# EAGLE design controller (EAGLE 8.6.3)

## Sheet 1 of 3
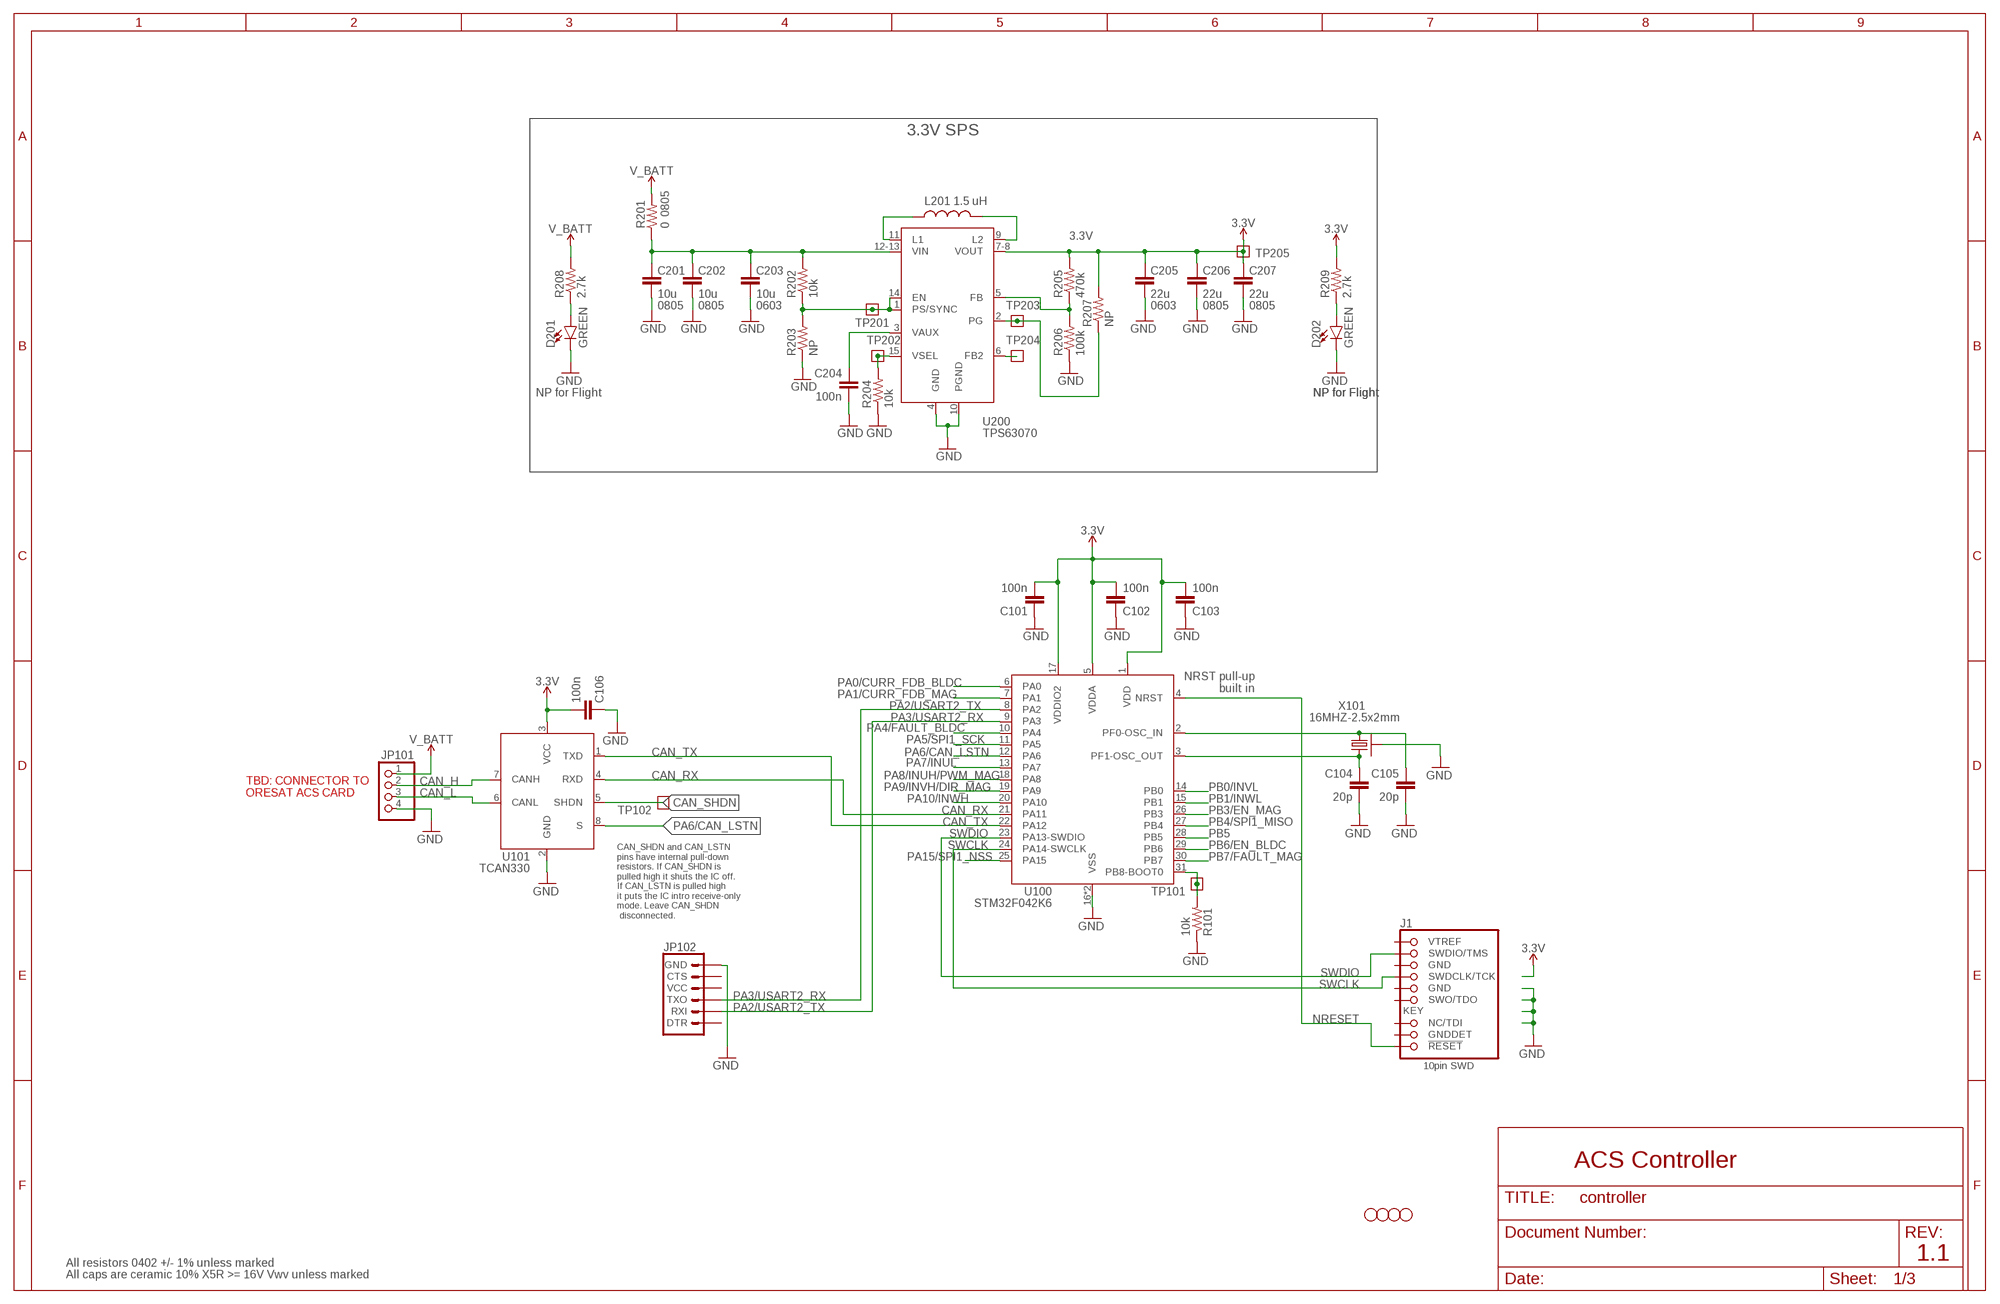
[diagram p0: schematic, sheet 1]

### Parts
C101  100n  C-EU0402-B-NOSILK  [.0402-B-NOSILK]
C102  100n  C-EU0402-B-NOSILK  [.0402-B-NOSILK]
C103  100n  C-EU0402-B-NOSILK  [.0402-B-NOSILK]
C104  20p  C-EU0402-B-NOSILK  [.0402-B-NOSILK]
C105  20p  C-EU0402-B-NOSILK  [.0402-B-NOSILK]
C106  100n  C-EU0402-B-NOSILK  [.0402-B-NOSILK]
C201  10u  C-EU0805-B-NOSILK  [.0805-B-NOSILK]
C202  10u  C-EU0805-B-NOSILK  [.0805-B-NOSILK]
C203  10u  C-EU0603-B-NOSILK  [.0603-B-NOSILK]
C204  100n  C-EU0402-B-NOSILK  [.0402-B-NOSILK]
C205  22u  C-EU0603-B-NOSILK  [.0603-B-NOSILK]
C206  22u  C-EU0805-B-NOSILK  [.0805-B-NOSILK]
C207  22u  C-EU0805-B-NOSILK  [.0805-B-NOSILK]
D201  GREEN  LED-GREEN0603  [LED-0603]
D202  GREEN  LED-GREEN0603  [LED-0603]
H1  STAND-OFFTIGHT  [STAND-OFF-TIGHT]
H2  STAND-OFFTIGHT  [STAND-OFF-TIGHT]
H3  STAND-OFFTIGHT  [STAND-OFF-TIGHT]
H4  STAND-OFFTIGHT  [STAND-OFF-TIGHT]
J1  1.27MM-SWD-CONNECTOR  [1.27MM_2X5]
JP101  PINHD-1X4  [1X04]
JP102  6_PIN_SERIAL_TARGETSILK  [6_PIN_SERIAL_TARGET_SIDE_W_SILK]
L201  1.5 uH  L-COILCRAFT-XFL4020  [L-COILCRAFT-XFL4020]
R101  10k  R-US_0402-B-NOSILK  [.0402-B-NOSILK]
R201  0  R-US_0805-B-NOSILK  [.0805-B-NOSILK]
R202  10k  R-US_0402-B-NOSILK  [.0402-B-NOSILK]
R203  NP  R-US_0402-B-NOSILK  [.0402-B-NOSILK]
R204  10k  R-US_0402-B-NOSILK  [.0402-B-NOSILK]
R205  470k  R-US_0402-B-NOSILK  [.0402-B-NOSILK]
R206  100k  R-US_0402-B-NOSILK  [.0402-B-NOSILK]
R207  NP  R-US_0402-B-NOSILK  [.0402-B-NOSILK]
R208  2.7k  R-US_0402-B-NOSILK  [.0402-B-NOSILK]
R209  2.7k  R-US_0402-B-NOSILK  [.0402-B-NOSILK]
TP101  TEST-POINT  [2MM-TEST-POINT]
TP102  TEST-POINT  [2MM-TEST-POINT]
TP201  TEST-POINT  [2MM-TEST-POINT]
TP202  TEST-POINT  [2MM-TEST-POINT]
TP203  TEST-POINT  [2MM-TEST-POINT]
TP204  TEST-POINT  [2MM-TEST-POINT]
TP205  TEST-POINT  [2MM-TEST-POINT]
U100  STM32F042K6  [QFP32-7X7]
U101  TCAN330  [SOT23-8_TI-DCN]
U200  TPS63070  TPS63070X  [TPS63070X]
X101  16MHZ-2.5x2mm  CRYSTAL-WITH-GND  [CRYSTAL_2.5X2]

### Nets
3.3V: C101.2 C102.2 C103.2 C106.2 C205.1 C206.1 C207.1 R205.2 R207.2 R209.2 TP205.1 U100.1(VDD) U100.5(VDDA) U100.17(VDDIO2) U101.3(VCC) U200.7-8(VOUT) ; also sheet 2,3
BOOT: R101.2 TP101.1 U100.31(PB8-BOOT0)
CAN_H: JP101.2 U101.7(CANH)
CAN_L: JP101.3 U101.6(CANL)
CAN_RX: U100.21(PA11) U101.4(RXD)
CAN_SHDN: TP102.1 U101.5(SHDN)
CAN_TX: U100.22(PA12) U101.1(TXD)
CRYSTALIN: C105.1 U100.2(PF0-OSC_IN) X101.1
CRYSTALOUT: C104.1 U100.3(PF1-OSC_OUT) X101.3
GND: C101.1 C102.1 C103.1 C104.2 C105.2 C106.1 C201.2 C202.2 C203.2 C204.2 C205.2 C206.2 C207.2 D201.C D202.C JP101.4 JP102.P$6(GND) R101.1 R203.1 R204.1 R206.1 U100.16(VSS) U100.32(VSS) U101.2(GND) U200.4(GND) U200.10(PGND) X101.2(SHIELD) X101.4(SHIELD) ; also sheet 2,3
N$270: D201.A R208.1
N$271: D202.A R209.1
NRESET: J1.!RESET U100.4(NRST)
PA0/CURR_FDB_BLDC: U100.6(PA0) ; also sheet 2
PA1/CURR_FDB_MAG: U100.7(PA1) ; also sheet 3
PA2/USART2_TX: JP102.P$2(TXO) U100.8(PA2)
PA3/USART2_RX: JP102.P$3(RXI) U100.9(PA3)
PA4/FAULT_BLDC: U100.10(PA4) ; also sheet 2
PA5/SPI1_SCK: U100.11(PA5) ; also sheet 2
PA6/CAN_LSTN: U100.12(PA6) U101.8(S)
PA7/INUL: U100.13(PA7) ; also sheet 2
PA8/INUH/PWM_MAG: U100.18(PA8) ; also sheet 2,3
PA9/INVH/DIR_MAG: U100.19(PA9) ; also sheet 2,3
PA10/INWH: U100.20(PA10) ; also sheet 2
PA15/SPI1_NSS: U100.25(PA15) ; also sheet 2
PB0/INVL: U100.14(PB0) ; also sheet 2
PB1/INWL: U100.15(PB1) ; also sheet 2
PB3/EN_MAG: U100.26(PB3) ; also sheet 3
PB4/SPI1_MISO: U100.27(PB4) ; also sheet 2
PB5: U100.28(PB5)
PB6/EN_BLDC: U100.29(PB6) ; also sheet 2
PB7/FAULT_MAG: U100.30(PB7) ; also sheet 3
SWCLK: J1.SWDCLK(SWDCLK/TCK) U100.24(PA14-SWCLK)
SWDIO: J1.SWDIO(SWDIO/TMS) U100.23(PA13-SWDIO)
TPS-EN: R202.1 R203.2 TP201.1 U200.1(PS/SYNC) U200.14(EN)
TPS-FB: R205.1 R206.2 U200.5(FB)
TPS-FB2: TP204.1 U200.6(FB2)
TPS-L1: L201.1 U200.11(L1)
TPS-L2: L201.2 U200.9(L2)
TPS-PG: R207.1 TP203.1 U200.2(PG)
TPS-VAUX: C204.1 U200.3(VAUX)
TPS-VIN: C201.1 C202.1 C203.1 R201.1 R202.2 U200.12-13(VIN)
TPS-VSEL: R204.2 TP202.1 U200.15(VSEL)
V_BATT: JP101.1 R201.2 R208.2 ; also sheet 2,3
Unconnected: J1.GND J1.GND@2(GND) J1.GNDDET J1.NC(NC/TDI) J1.SWO(SWO/TDO) J1.VTREF JP102.P$1(DTR) JP102.P$4(VCC) JP102.P$5(CTS)

### Notes on the sheet
- 3.3V SPS
- 0805
- 0805 | 0805 | 0603 | 0603 | 0805 | 0805
- NP for Flight | NP for Flight | NP for Flight
- NRST pull-up
  built in
- TBD: CONNECTOR TO 
  ORESAT ACS CARD
- CAN_SHDN and CAN_LSTN
  pins have internal pull-down
  resistors. If CAN_SHDN is 
  pulled high it shuts the IC off.
  If CAN_LSTN is pulled high
  it puts the IC intro receive-only
  mode. Leave CAN_SHDN
   disconnected.
- ACS Controller
- 1.1
- All resistors 0402 +/- 1% unless marked
- All caps are ceramic 10% X5R >= 16V Vwv unless marked

## Sheet 2 of 3
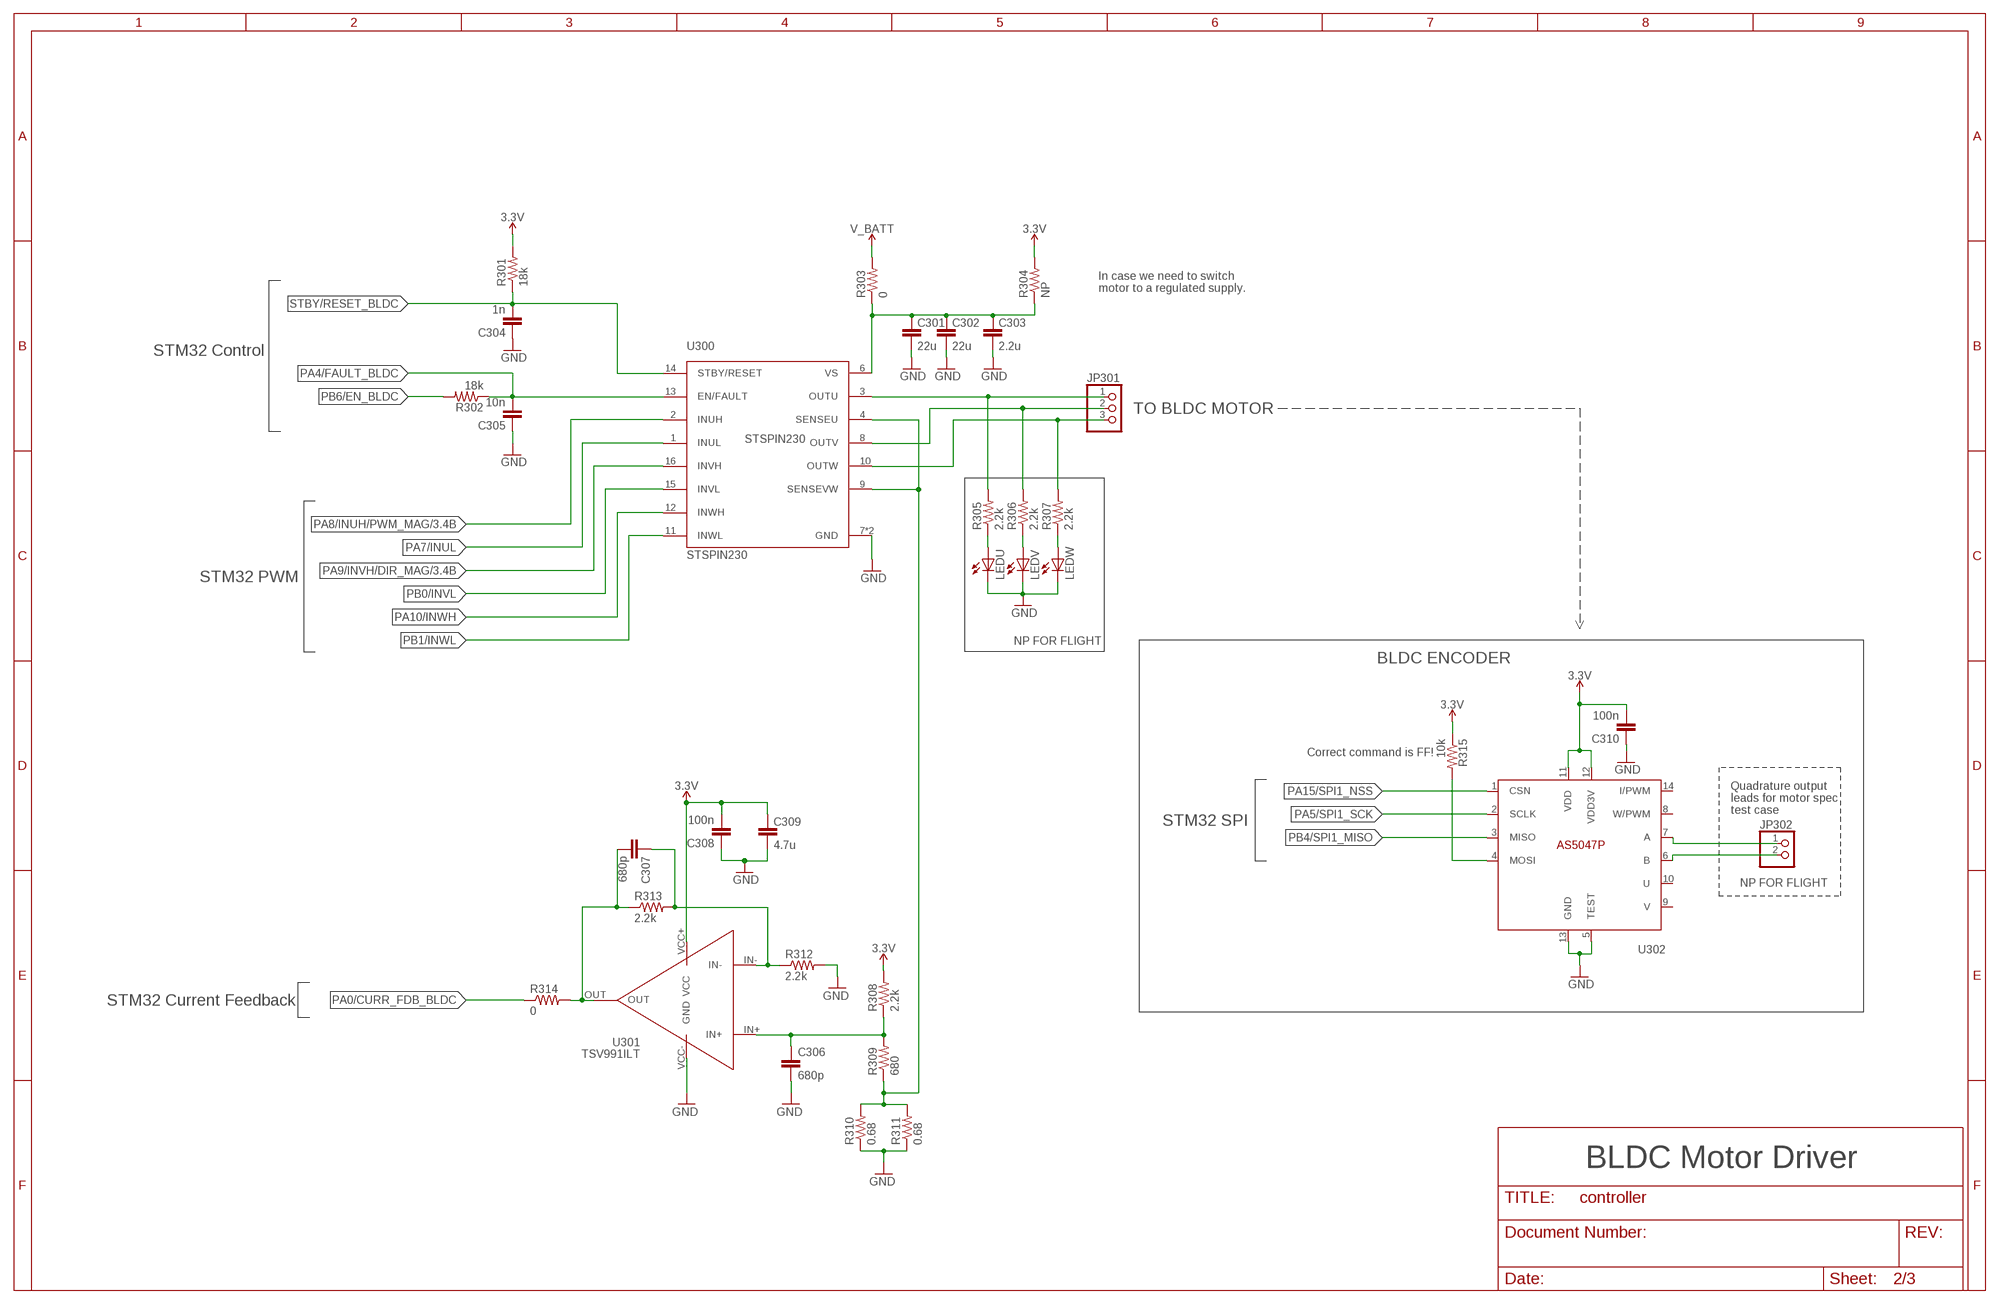
[diagram p1: schematic, sheet 2]

### Parts
C301  22u  C-EU0603-B-NOSILK  [.0603-B-NOSILK]
C302  22u  C-EU0603-B-NOSILK  [.0603-B-NOSILK]
C303  2.2u  C-EU0603-B-NOSILK  [.0603-B-NOSILK]
C304  1n  C-EU0402-B-NOSILK  [.0402-B-NOSILK]
C305  10n  C-EU0402-B-NOSILK  [.0402-B-NOSILK]
C306  680p  C-EU0402-B-NOSILK  [.0402-B-NOSILK]
C307  680p  C-EU0402-B-NOSILK  [.0402-B-NOSILK]
C308  100n  C-EU0402-B-NOSILK  [.0402-B-NOSILK]
C309  4.7u  C-EU0603-B-NOSILK  [.0603-B-NOSILK]
C310  100n  C-EU0402-B-NOSILK  [.0402-B-NOSILK]
JP301  PINHD-1X3  [1X03]
JP302  PINHD-1X2  [1X02]
LEDU  LEDCHIP-LED0603  [CHIP-LED0603]
LEDV  LEDCHIP-LED0603  [CHIP-LED0603]
LEDW  LEDCHIP-LED0603  [CHIP-LED0603]
R301  18k  R-US_0402-B-NOSILK  [.0402-B-NOSILK]
R302  18k  R-US_0402-B-NOSILK  [.0402-B-NOSILK]
R303  0  R-US_0805-B-NOSILK  [.0805-B-NOSILK]
R304  NP  R-US_0805-B-NOSILK  [.0805-B-NOSILK]
R305  2.2k  R-US_0805-B-NOSILK  [.0805-B-NOSILK]
R306  2.2k  R-US_0805-B-NOSILK  [.0805-B-NOSILK]
R307  2.2k  R-US_0805-B-NOSILK  [.0805-B-NOSILK]
R308  2.2k  R-US_0402-B-NOSILK  [.0402-B-NOSILK]
R309  680  R-US_0402-B-NOSILK  [.0402-B-NOSILK]
R310  0.68  R-US_0805-B-NOSILK  [.0805-B-NOSILK]
R311  0.68  R-US_0805-B-NOSILK  [.0805-B-NOSILK]
R312  2.2k  R-US_0402-B-NOSILK  [.0402-B-NOSILK]
R313  2.2k  R-US_0402-B-NOSILK  [.0402-B-NOSILK]
R314  0  R-US_0402-B-NOSILK  [.0402-B-NOSILK]
R315  10k  R-US_0402-B-NOSILK  [.0402-B-NOSILK]
U300  STSPIN230  [VFQFPN]
U301  TSV991ILT  [SOT23-5]
U302  AS5047P  [TSSOP14]

### Nets
3.3V: C308.2 C309.1 C310.2 R301.2 R304.2 R308.2 R315.1 U301.VCC+(VCC) U302.11(VDD) U302.12(VDD3V) ; also sheet 1,3
GND: C301.2 C302.2 C303.2 C304.1 C305.1 C306.2 C308.1 C309.2 C310.1 LEDU.C LEDV.C LEDW.C R310.1 R311.1 R312.2 U300.7(GND) U300.EPAD(GND) U301.VCC-(GND) U302.5(TEST) U302.13(GND) ; also sheet 1,3
N$1: R315.2 U302.4(MOSI)
N$4: JP302.1 U302.7(A)
N$6: LEDU.A R305.1
N$10: LEDV.A R306.1
N$11: LEDW.A R307.1
N$12: C301.1 C302.1 C303.1 R303.1 R304.1 U300.6(VS)
N$13: JP302.2 U302.6(B)
N$14: C307.1 R312.1 R313.2 U301.IN-
N$16: C306.1 R308.1 R309.2 U301.IN+
N$29: C307.2 R313.1 R314.2 U301.OUT
PA0/CURR_FDB_BLDC: R314.1 ; also sheet 1
PA4/FAULT_BLDC: C305.2 R302.1 U300.13(EN/FAULT) ; also sheet 1
PA5/SPI1_SCK: U302.2(SCLK) ; also sheet 1
PA7/INUL: U300.1(INUL) ; also sheet 1
PA8/INUH/PWM_MAG: U300.2(INUH) ; also sheet 1,3
PA9/INVH/DIR_MAG: U300.16(INVH) ; also sheet 1,3
PA10/INWH: U300.12(INWH) ; also sheet 1
PA15/SPI1_NSS: U302.1(CSN) ; also sheet 1
PB0/INVL: U300.15(INVL) ; also sheet 1
PB1/INWL: U300.11(INWL) ; also sheet 1
PB4/SPI1_MISO: U302.3(MISO) ; also sheet 1
PB6/EN_BLDC: R302.2 ; also sheet 1
SENSE_BLDC: R309.1 R310.2 R311.2 U300.4(SENSEU) U300.9(SENSEVW)
STBY/RESET_BLDC: C304.2 R301.1 U300.14(STBY/RESET)
U: JP301.1 R305.2 U300.3(OUTU)
V: JP301.2 R306.2 U300.8(OUTV)
V_BATT: R303.2 ; also sheet 1,3
W: JP301.3 R307.2 U300.10(OUTW)
Unconnected: U302.8(W/PWM) U302.9(V) U302.10(U) U302.14(I/PWM)

### Notes on the sheet
- In case we need to switch 
  motor to a regulated supply.
- STM32 Control
- TO BLDC MOTOR
- STM32 PWM
- NP FOR FLIGHT
- BLDC ENCODER
- Correct command is FF!
- Quadrature output
  leads for motor spec
  test case
- STM32 SPI
- NP FOR FLIGHT
- STM32 Current Feedback
- BLDC Motor Driver

## Sheet 3 of 3
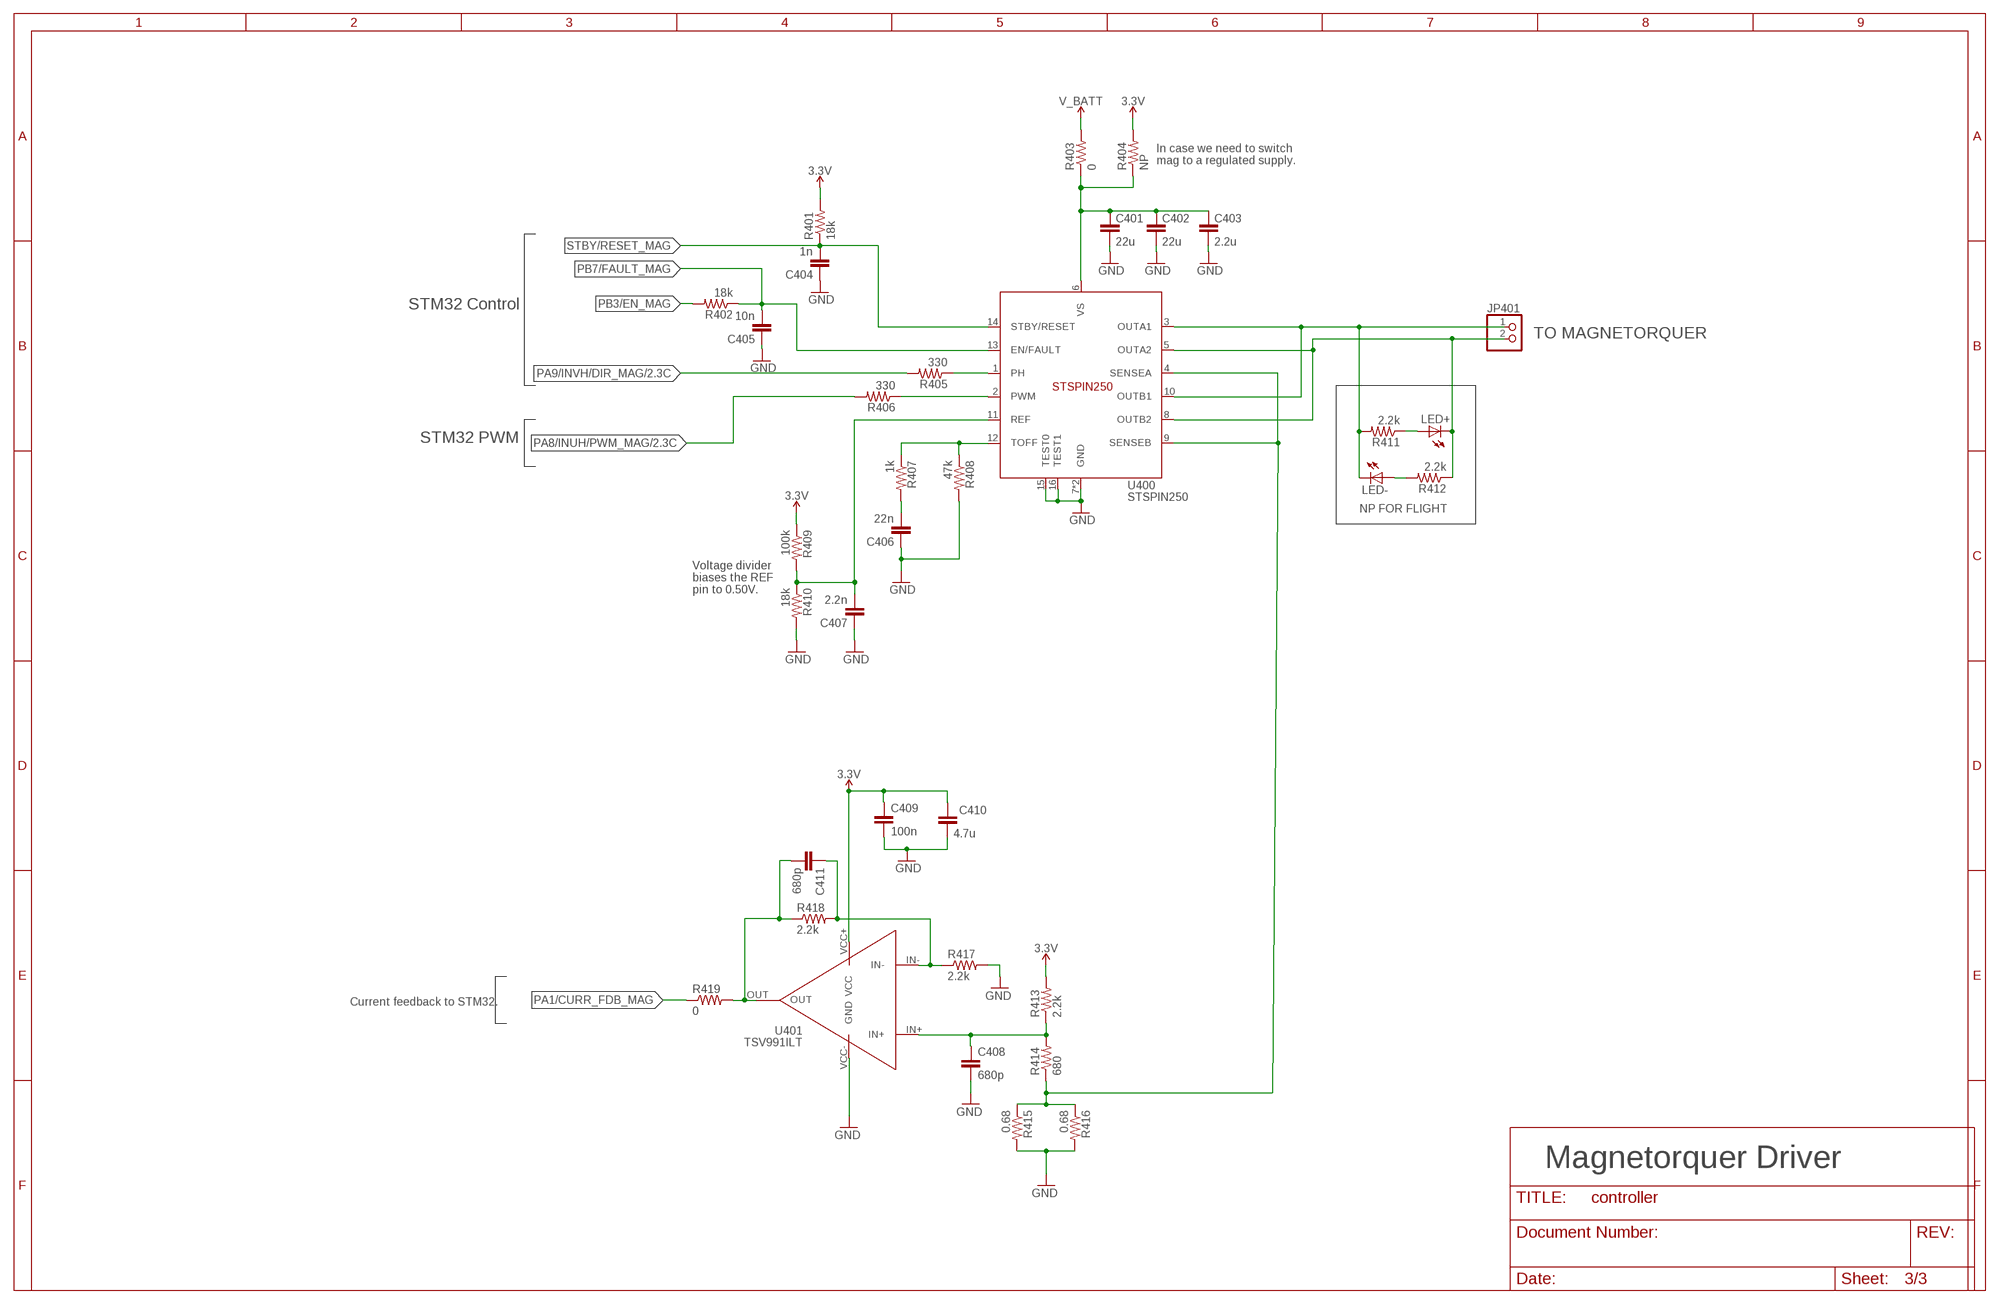
[diagram p2: schematic, sheet 3]

### Parts
C401  22u  C-EU0603-B-NOSILK  [.0603-B-NOSILK]
C402  22u  C-EU0603-B-NOSILK  [.0603-B-NOSILK]
C403  2.2u  C-EU0603-B-NOSILK  [.0603-B-NOSILK]
C404  1n  C-EU0402-B-NOSILK  [.0402-B-NOSILK]
C405  10n  C-EU0402-B-NOSILK  [.0402-B-NOSILK]
C406  22n  C-EU0402-B-NOSILK  [.0402-B-NOSILK]
C407  2.2n  C-EU0402-B-NOSILK  [.0402-B-NOSILK]
C408  680p  C-EU0402-B-NOSILK  [.0402-B-NOSILK]
C409  100n  C-EU0402-B-NOSILK  [.0402-B-NOSILK]
C410  4.7u  C-EU0603-B-NOSILK  [.0603-B-NOSILK]
C411  680p  C-EU0402-B-NOSILK  [.0402-B-NOSILK]
JP401  PINHD-1X2  [1X02]
LED+  LEDCHIP-LED0603  [CHIP-LED0603]
LED-  LEDCHIP-LED0603  [CHIP-LED0603]
R401  18k  R-US_0402-B-NOSILK  [.0402-B-NOSILK]
R402  18k  R-US_0402-B-NOSILK  [.0402-B-NOSILK]
R403  0  R-US_0805-B-NOSILK  [.0805-B-NOSILK]
R404  NP  R-US_0805-B-NOSILK  [.0805-B-NOSILK]
R405  330  R-US_0402-B-NOSILK  [.0402-B-NOSILK]
R406  330  R-US_0402-B-NOSILK  [.0402-B-NOSILK]
R407  1k  R-US_0402-B-NOSILK  [.0402-B-NOSILK]
R408  47k  R-US_0402-B-NOSILK  [.0402-B-NOSILK]
R409  100k  R-US_0402-B-NOSILK  [.0402-B-NOSILK]
R410  18k  R-US_0402-B-NOSILK  [.0402-B-NOSILK]
R411  2.2k  R-US_0805-B-NOSILK  [.0805-B-NOSILK]
R412  2.2k  R-US_0805-B-NOSILK  [.0805-B-NOSILK]
R413  2.2k  R-US_0402-B-NOSILK  [.0402-B-NOSILK]
R414  680  R-US_0402-B-NOSILK  [.0402-B-NOSILK]
R415  0.68  R-US_0805-B-NOSILK  [.0805-B-NOSILK]
R416  0.68  R-US_0805-B-NOSILK  [.0805-B-NOSILK]
R417  2.2k  R-US_0402-B-NOSILK  [.0402-B-NOSILK]
R418  2.2k  R-US_0402-B-NOSILK  [.0402-B-NOSILK]
R419  0  R-US_0402-B-NOSILK  [.0402-B-NOSILK]
U400  STSPIN250  [VFQPN]
U401  TSV991ILT  [SOT23-5]

### Nets
3.3V: C409.1 C410.1 R401.2 R404.2 R409.1 R413.2 U401.VCC+(VCC) ; also sheet 1,2
GND: C401.2 C402.2 C403.2 C404.1 C405.1 C406.1 C407.1 C408.2 C409.2 C410.2 R408.2 R410.2 R415.2 R416.2 R417.2 U400.7(GND) U400.15(TEST0) U400.16(TEST1) U400.EPAD(GND) U401.VCC-(GND) ; also sheet 1,2
N$2: C406.2 R407.2
N$3: R406.1 U400.2(PWM)
N$5: R405.1 U400.1(PH)
N$15: C408.1 R413.1 R414.2 U401.IN+
N$17: C411.1 R417.1 R418.2 U401.IN-
N$19: R407.1 R408.1 U400.12(TOFF)
N$20: C401.1 C402.1 C403.1 R403.1 R404.1 U400.6(VS)
N$22: LED+.A R411.1
N$23: LED-.A R412.2
N$25: C407.2 R409.2 R410.1 U400.11(REF)
N$27: C411.2 R418.1 R419.2 U401.OUT
OUT1: JP401.1 LED-.C R411.2 U400.3(OUTA1) U400.10(OUTB1)
OUT2: JP401.2 LED+.C R412.1 U400.5(OUTA2) U400.8(OUTB2)
PA1/CURR_FDB_MAG: R419.1 ; also sheet 1
PA8/INUH/PWM_MAG: R406.2 ; also sheet 1,2
PA9/INVH/DIR_MAG: R405.2 ; also sheet 1,2
PB3/EN_MAG: R402.2 ; also sheet 1
PB7/FAULT_MAG: C405.2 R402.1 U400.13(EN/FAULT) ; also sheet 1
SENSE_MAG: R414.1 R415.1 R416.1 U400.4(SENSEA) U400.9(SENSEB)
STBY/RESET_MAG: C404.2 R401.1 U400.14(STBY/RESET)
V_BATT: R403.2 ; also sheet 1,2

### Notes on the sheet
- In case we need to switch 
  mag to a regulated supply.
- STM32 Control
- TO MAGNETORQUER
- STM32 PWM
- NP FOR FLIGHT
- Voltage divider
  biases the REF
  pin to 0.50V.
- Current feedback to STM32.
- Magnetorquer Driver

## Library data of the parts
C101-C103 C106 C204 C304-C308 C310 C404-C409 C411 = rcl_custom:C-EU: CAPACITOR, European symbol; DIS: Digi-Key; DPN: 1276-1001-1-ND; MFR: Samsung; MPN: CL05B104KO5NNNC
C104 C105 = rcl_custom:C-EU: CAPACITOR, European symbol; DIS: Digi-Key; DPN: 1276-6601-1-ND; MFR: Samsung; MPN: CL05C200JB51PNC
C201 C202 C206 C207 = oresat-rcl:C-EU: CAPACITOR, European symbol
C203 C205 C301-C303 C309 C401-C403 C410 = oresat-rcl:C-EU: CAPACITOR, European symbol; DIS: Digi-Key; DPN: 1276-1001-1-ND; MFR: Samsung; MPN: CL05B104KO5NNNC
D201 D202 = SparkFun-LED:LED-GREEN: Green SMD LED Used in manufacturing of various products at SparkFun Packages: 0603 - SMD 0603 package [Product Link] <http://www.futureelectronics.com/en/technologies/semiconductors/optoelectronics/leds/Pages/9894312-LTST-C190GKT.aspx?CrossPart=HSMG-C190&IM=0> LilyPad 1206 - SMD1206 LilyPad package [Product Link] <http://www.futureelectronics.com/en/Technologies/Product.aspx?ProductID=IN150NGHARVATEKCORPORATION2049943&IM=0> 1206 - SMD1206 package [Product Link] <http://www.futureelectronics.com/en/technologies/semiconductors/optoelectronics/leds/Pages/8315665-LTST-C150KGKT.aspx?IM=0> 1206 Bottom Mount -SMD 1206 Bottom Mount [Product Link] <http://www.digikey.com/product-detail/en/lite-on-inc/LTST-C230KGKT/160-1456-1-ND/386854> SparkFun Products: Pro Mini 328 -5V <https://www.sparkfun.com/products/821> RedBoard <https://www.sparkfun.com/products/12757> MP3 Trigger <https://www.sparkfun.com/products/13720> Makey Makey <https://www.sparkfun.com/products/11076>; PROD_ID: DIO-00821
H1-H4 = SparkFun-Hardware:STAND-OFF: Stand Off Drill holes for mechanically mounting via screws, standoffs, etc. Note: Use the keepout ring to avoid running the screw head into surrounding components. Variant Overviews STAND-OFF - Mechanical footprint for a #4 phillips button head screw. STAND-OFF-TIGHT - Mechanical footprint for a #4 phillips button head screw, Example SparkFun Products Screw - Phillips Head (1/4", 4-40, 10 pack) <https://www.sparkfun.com/products/10453> (PRT-10453) Screw - Phillips Head (1/2", 4-40, 10 pack) <https://www.sparkfun.com/products/10452> (PRT-10452) Screw - Phillips Head (3/4", 4-40, 10 pack) <https://www.sparkfun.com/products/10451> (PRT-10451) Screw - Phillips Head (1", 4-40, 10 pack) <https://www.sparkfun.com/products/10450> (PRT-10450)
J1 = J-CNC-3220-10-0100-00-ARM-SWD-port:1.27MM-SWD-CONNECTOR: ARM SWD Programming Header. Example part is the CNC 3220-10-0100-00
JP101 = pinhead:PINHD-1X4: PIN HEADER
JP102 = SparkFun-Connectors:6_PIN_SERIAL_TARGET: 6-pin header connection for use with the "FTDI BASIC" pinout - TARGET SIDE. Also known as "Arduino Serial Program Header". It is used to mate with our FTDI Basic serial programmers using the Arduino IDE. Note, this device has "TARGET" in the name. It is intended to be used on a design that contains a target micro-controller that you wish to program. The "sister" device, named "CABLE" is inteneded to be used on a design that usually lives on the end of your USB cable and prvides the converter chip (FTDI232 or FTDI231x) to commnicate serial RX/TX. You can populate with some of these: Break Away Headers - Straight <https://www.sparkfun.com/products/116> (PRT-00116) For reference (or to suit your programming needs) check out these designs: SparkFun FTDI Basic Breakout - 5V <https://www.sparkfun.com/products/9716> (DEV-09716) SparkFun FTDI Basic Breakout - 3.3V <https://www.sparkfun.com/products/9873> (DEV-09873) SparkFun FTDI SmartBasic <https://www.sparkfun.com/products/12935> (DEV-12935) SparkFun Beefy 3 - FTDI Basic Breakout <https://www.sparkfun.com/products/13746> (DEV-13746)
JP301 = adafruit:PINHD-1X3: PIN HEADER
JP302 JP401 = pinhead:PINHD-1X2: PIN HEADER
L201 = L-Coilcraft-XFL4020:L-COILCRAFT-XFL4020; DIS: Mouser; DPN: 994-XFL4020-152MEB; MFR: Coilcraft; MPN: XFL4020-152ME
LED+ LED- LEDU LEDV LEDW = adafruit:LED: LED OSRAM: - CHIPLED LG R971, LG N971, LY N971, LG Q971, LY Q971, LO R971, LY R971 LH N974, LH R974 LS Q976, LO Q976, LY Q976 LO Q996 - Hyper CHIPLED LW Q18S LB Q993, LB Q99A, LB R99A - SideLED LS A670, LO A670, LY A670, LG A670, LP A670 LB A673, LV A673, LT A673, LW A673 LH A674 LY A675 LS A676, LA A676, LO A676, LY A676, LW A676 LS A679, LY A679, LG A679 - Hyper Micro SIDELED® LS Y876, LA Y876, LO Y876, LY Y876 LT Y87S - SmartLED LW L88C, LW L88S LB L89C, LB L89S, LG L890 LS L89K, LO L89K, LY L89K LS L896, LA L896, LO L896, LY L896 - TOPLED LS T670, LO T670, LY T670, LG T670, LP T670 LSG T670, LSP T670, LSY T670, LOP T670, LYG T670 LG T671, LOG T671, LSG T671 LB T673, LV T673, LT T673, LW T673 LH T674 LS T676, LA T676, LO T676, LY T676, LB T676, LH T676, LSB T676, LW T676 LB T67C, LV T67C, LT T67C, LS T67K, LO T67K, LY T67K, LW E67C LS E67B, LA E67B, LO E67B, LY E67B, LB E67C, LV E67C, LT E67C LW T67C LS T679, LY T679, LG T679 LS T770, LO T770, LY T770, LG T770, LP T770 LB T773, LV T773, LT T773, LW T773 LH T774 LS E675, LA E675, LY E675, LS T675 LS T776, LA T776, LO T776, LY T776, LB T776 LHGB T686 LT T68C, LB T68C - Hyper Mini TOPLED® LB M676 - Mini TOPLED Santana® LG M470 LS M47K, LO M47K, LY M47K Source: http://www.osram.convergy.de/
R101 R202-R209 R301 R302 R308 R309 R312-R315 R401 R402 R405-R410 R413 R414 R417-R419 = rcl_custom:R-US_: RESISTOR, American symbol; DIS: Digi-Key; DPN: 1276-4275-1-ND; MFR: Samsung; MPN: RC1005F6653CS
R201 = rcl_custom:R-US_: RESISTOR, American symbol; DIS: Digi-Key; DPN: RHM0.0ARCT-ND; MFR: Rohm; MPN: MCR10EZPJ000
R303-R307 R310 R311 R403 R404 R411 R412 R415 R416 = oresat-rcl:R-US_: RESISTOR, American symbol
TP101 TP102 TP201-TP205 = Tova:TEST-POINT
U100 = STM32F042K:STM32F042K6; DIS: Digi-Key; DPN: STM32F042K6T7-ND; MFR: STMicroelectronics; MPN: STM32F042K6T7
U101 = TCAN330:TCAN330; DIS: Digi-Key; DPN: 296-44211-1-ND; MFR: Texas Instruments; MPN: TCAN330GDCNT
U200 = ic-pwr-tps63070x:TPS63070X: TPS63070 2-V to 16-V Buck-Boost Converter With 3.6-A Switch Current
U300 = U-ST-STSPIN230-BLDC-controller:STSPIN230
U301 U401 = TSV991ILT:TSV991ILT
U302 = U-AMS-AS5047P-encoder:AS5047P
U400 = U-ST-STSPIN250-Brushed-DC-controller:STSPIN250
X101 = low-gain-radio:CRYSTAL-WITH-GND; DIS: Digi-Key; DPN: XC2181CT-ND; MFR: ECS Inc.; MPN: ECS-160-10-36Q-ES-TR

## Board
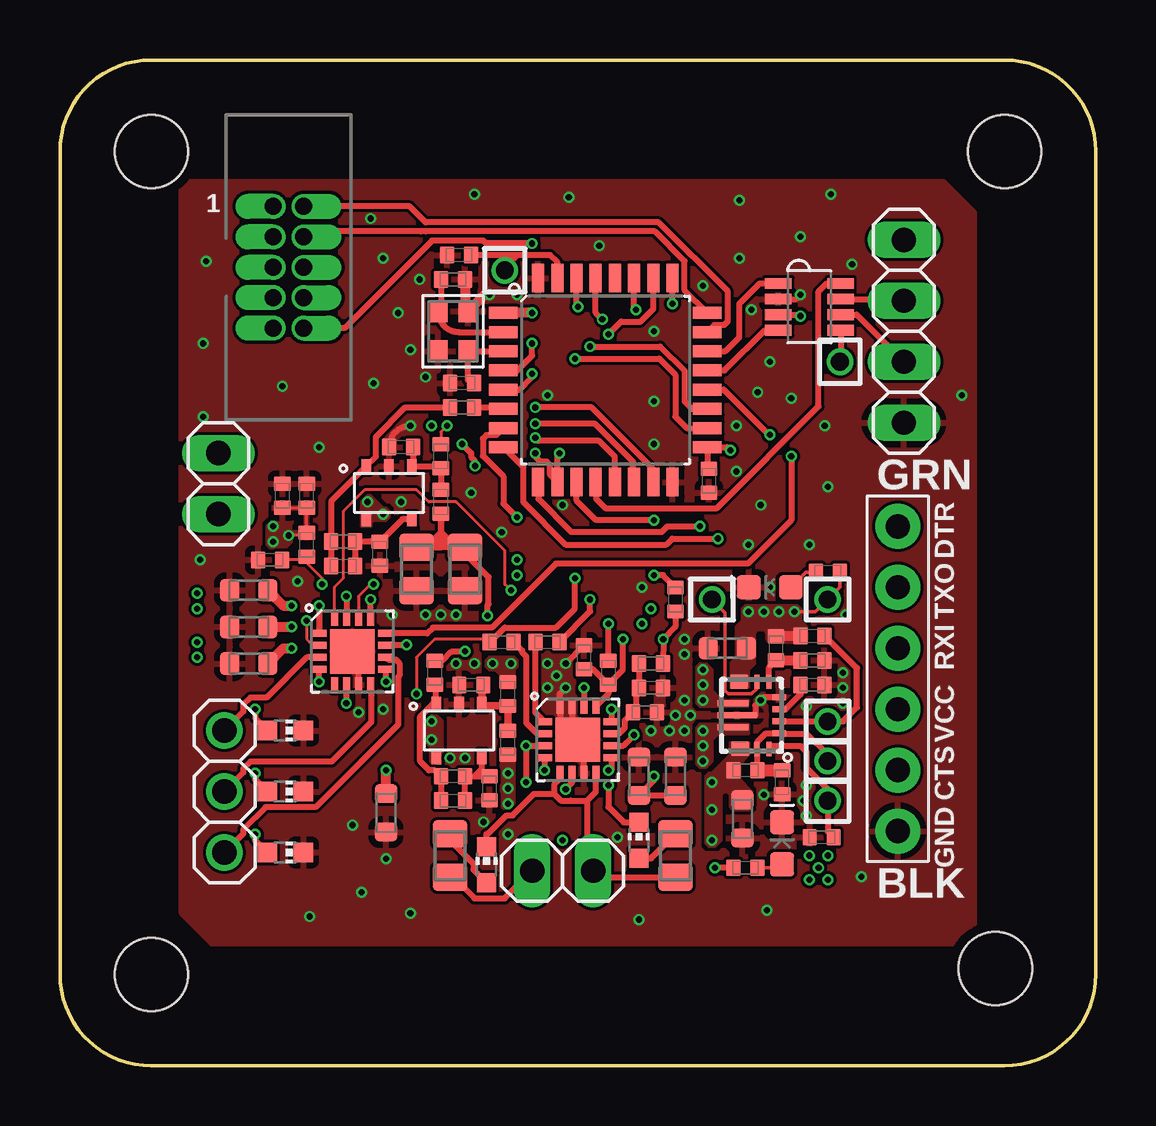
[diagram p3: board, top side]
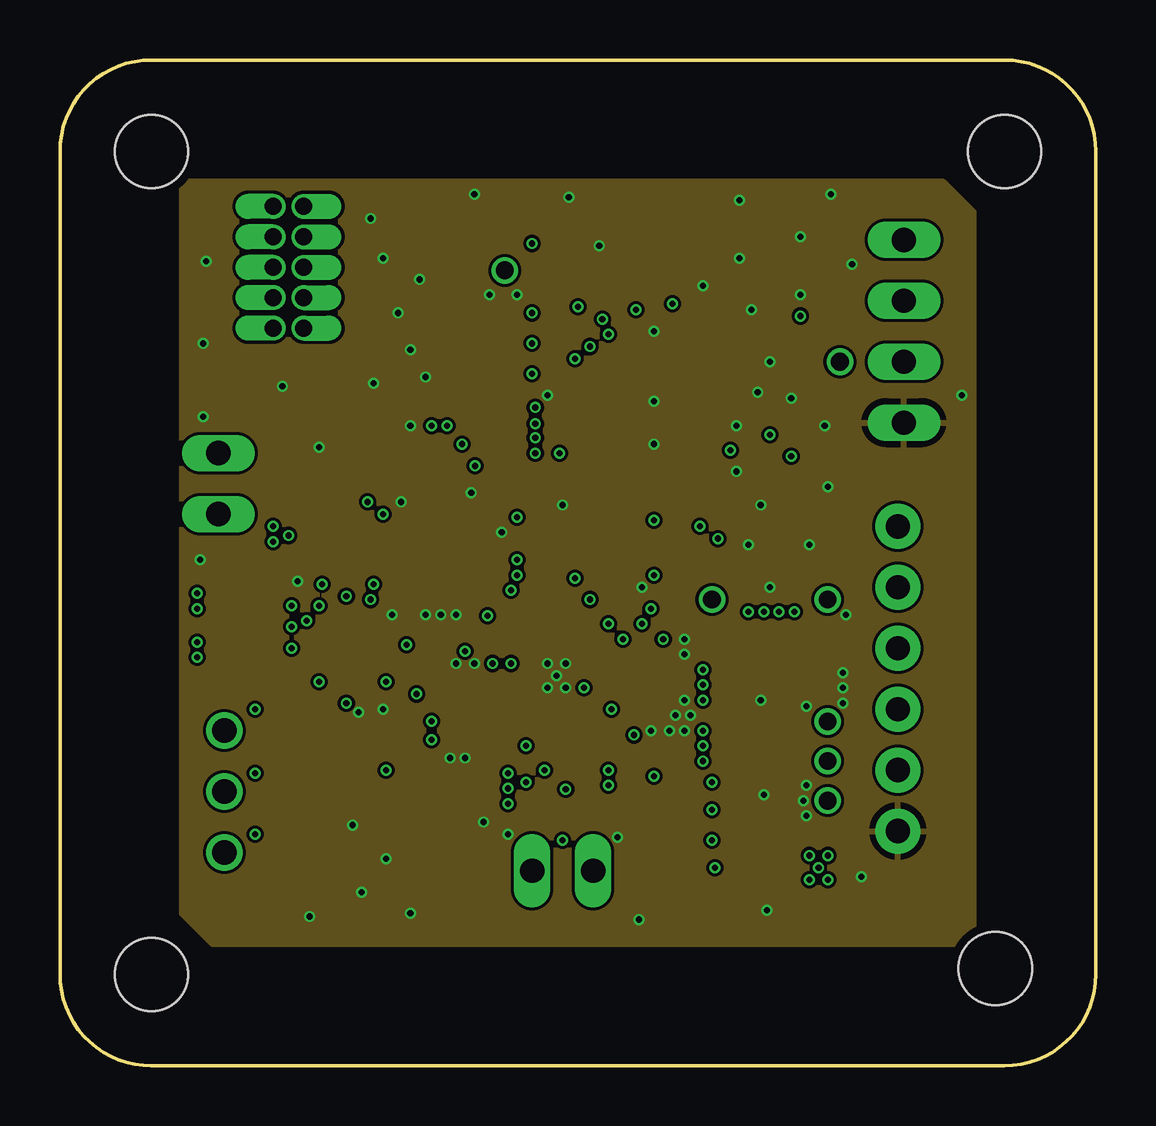
[diagram p4: board, inner layer Route2]
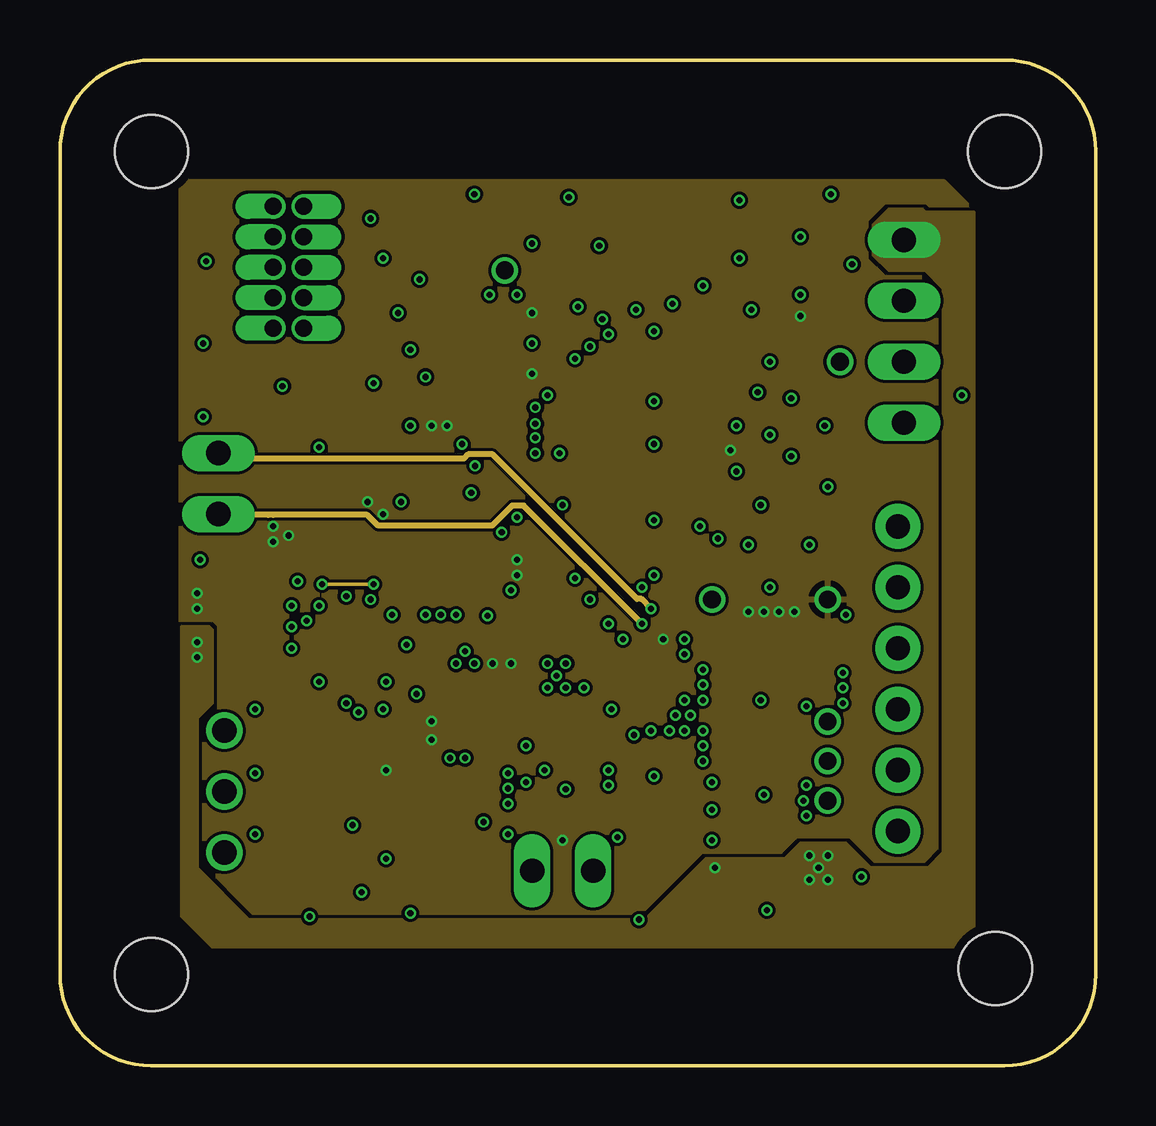
[diagram p5: board, inner layer Route15]
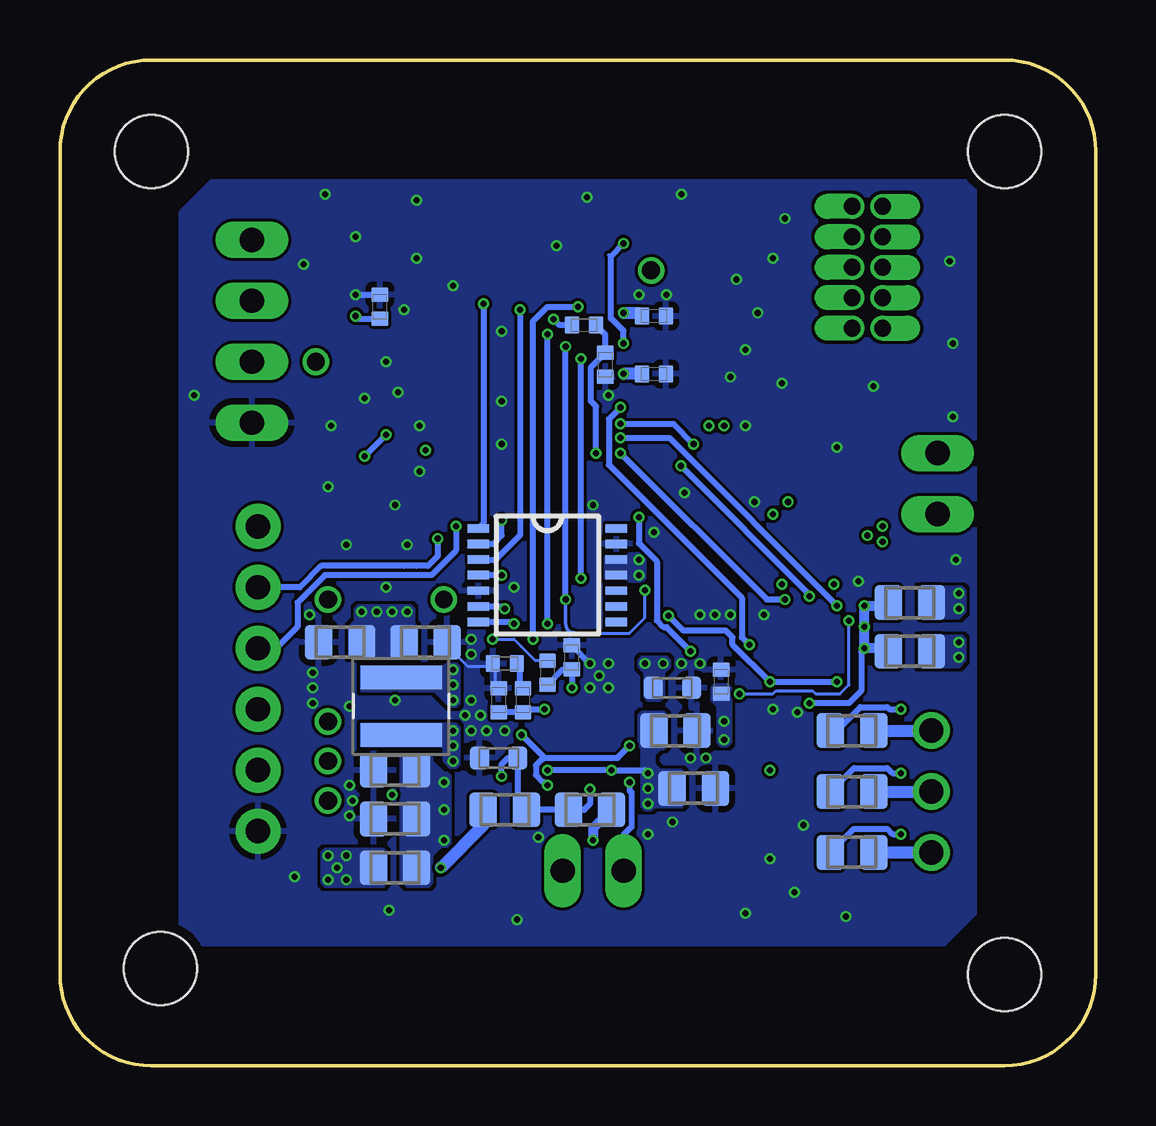
[diagram p6: board, bottom side, seen from below]

Size 43.18 x 41.91 mm. Coordinates in mm from the lower left corner, seen from the top.
Outline: 0,3.81 arc90 3.81,0 39.37,0 arc90 43.18,3.81 43.18,38.1 arc90 39.37,41.91 3.81,41.91 arc90 0,38.1 0,3.81
Copper layers (1*2*15*16): Top 0.035559375mm / dielectric 0.17018125mm / Route2 0.01778125mm / dielectric 47mil / Route15 0.01778125mm / dielectric 0.17018125mm / Bottom 0.035559375mm
Design rules "oshpark-4layer": minimum track width 5mil, minimum drill 10mil, track to track 5mil, track to pad 5mil, pad to pad 5mil, via to via 5mil, smd to smd 5mil, copper to edge 15mil, drill to drill 6mil, minimum pad ring 4mil, minimum via ring 4mil, stop-mask expansion 2.5mil, vias tented up to drill 0mil, thermal gap 10mil

### Footprints (pad centres in the part's own frame; a part is rotated, then mirrored left to right if it is on the bottom)
.0402-B-NOSILK = smd 0.6 x 0.7: 1 -0.5,0; 2 0.5,0
.0805-B-NOSILK = smd 1.15 x 1.45: 1 -0.9,0; 2 0.9,0
.0603-B-NOSILK = smd 0.8 x 0.95: 1 -0.8,0; 2 0.8,0
LED-0603 = smd 1 x 1: A -0.877,0; C 0.877,0
STAND-OFF-TIGHT = hole 3.048: 0,0
1.27MM_2X5 = drill 0.7 pad 1.016 offset: !RESET 0.635,-2.54; GND -0.635,1.27; GND@2 -0.635,0; GNDDET -0.635,-2.54; KEY -0.635,-1.27; NC 0.635,-1.27; SWDCLK 0.635,1.27; SWDIO 0.635,2.54; SWO 0.635,0; VTREF -0.635,2.54
1X04 = drill 1.016 long: 1 -3.81,0; 2 -1.27,0; 3 1.27,0; 4 3.81,0
6_PIN_SERIAL_TARGET_SIDE_W_SILK = drill 1.016 pad 1.88: P$1 -6.35,0; P$2 -3.81,0; P$3 -1.27,0; P$4 1.27,0; P$5 3.81,0; P$6 6.35,0
1X03 = drill 1.016: 1 -2.54,0; 2 0,0; 3 2.54,0
1X02 = drill 1.016 long: 1 -1.27,0; 2 1.27,0
L-COILCRAFT-XFL4020 = smd 0.98 x 3.4: 1 -1.2,0; 2 1.2,0
CHIP-LED0603 = smd 0.8 x 0.8: A 0,-0.75; C 0,0.75
2MM-TEST-POINT = drill 0.737: 1 0,0
QFP32-7X7 = smd 1.2 x 0.5: 1 -4.25,2.8; 2 -4.25,2; 3 -4.25,1.2; 4 -4.25,0.4; 5 -4.25,-0.4; 6 -4.25,-1.2; 7 -4.25,-2; 8 -4.25,-2.8; 17 4.25,-2.8; 18 4.25,-2; 19 4.25,-1.2; 20 4.25,-0.4; 21 4.25,0.4; 22 4.25,1.2; 23 4.25,2; 24 4.25,2.8 | smd 0.5 x 1.2: 9 -2.8,-4.25; 10 -2,-4.25; 11 -1.2,-4.25; 12 -0.4,-4.25; 13 0.4,-4.25; 14 1.2,-4.25; 15 2,-4.25; 16 2.8,-4.25; 25 2.8,4.25; 26 2,4.25; 27 1.2,4.25; 28 0.4,4.25; 29 -0.4,4.25; 30 -1.2,4.25; 31 -2,4.25; 32 -2.8,4.25
SOT23-8_TI-DCN = smd 0.45 x 1.1: 1 -0.975,-1.3; 2 -0.325,-1.3; 3 0.325,-1.3; 4 0.975,-1.3; 5 0.975,1.3; 6 0.325,1.3; 7 -0.325,1.3; 8 -0.975,1.3
TPS63070X = smd 0.6 x 0.25: 1 -1.15,0.75; 2 -1.15,0.25; 3 -1.15,-0.25; 4 -1.15,-0.75 | smd 0.25 x 0.6: 5 -0.725,-1.4; 6 -0.225,-1.4; 14 -0.225,1.4; 15 -0.725,1.4 | smd 0.75 x 0.6: 7-8 0.525,-1.4; 12-13 0.475,1.4 | smd 1.35 x 0.25: 9 0.775,-0.5; 11 0.775,0.5 | smd 1.7 x 0.25: 10 0.6,0
VFQFPN = smd 0.63 x 0.3: 1 -1.39,0.75; 2 -1.39,0.25; 3 -1.39,-0.25; 4 -1.39,-0.75; 9 1.39,-0.75; 10 1.39,-0.25; 11 1.39,0.25; 12 1.39,0.75 | smd 0.3 x 0.63: 5 -0.75,-1.39; 6 -0.25,-1.39; 7 0.25,-1.39; 8 0.75,-1.39; 13 0.75,1.39; 14 0.25,1.39; 15 -0.25,1.39; 16 -0.75,1.39 | smd 1.85 x 1.85: EPAD 0,0
SOT23-5 = smd 0.4 x 0.6: IN+ 0.95,1.1; IN- 0.95,-1.1; OUT -0.95,1.1; VCC+ -0.95,-1.1; VCC- 0,1.1
TSSOP14 = smd 0.9 x 0.35: 1 -2.875,1.95; 2 -2.875,1.3; 3 -2.875,0.65; 4 -2.875,0; 5 -2.875,-0.65; 6 -2.875,-1.3; 7 -2.875,-1.95; 8 2.875,-1.95; 9 2.875,-1.3; 10 2.875,-0.65; 11 2.875,0; 12 2.875,0.65; 13 2.875,1.3; 14 2.875,1.95
VFQPN = smd 0.63 x 0.3: 1 -1.39,0.75; 2 -1.39,0.25; 3 -1.39,-0.25; 4 -1.39,-0.75; 9 1.39,-0.75; 10 1.39,-0.25; 11 1.39,0.25; 12 1.39,0.75 | smd 0.3 x 0.63: 5 -0.75,-1.39; 6 -0.25,-1.39; 7 0.25,-1.39; 8 0.75,-1.39; 13 0.75,1.39; 14 0.25,1.39; 15 -0.25,1.39; 16 -0.75,1.39 | smd 1.85 x 1.85: EPAD 0,0
CRYSTAL_2.5X2 = smd 0.9 x 0.8: 1 -0.825,-0.625; 2 0.825,-0.625; 3 0.825,0.625; 4 -0.825,0.625

### Placement (x,y rotation side)
C101  18.41,31.24 180 bottom
C102  18.41,28.83 180 bottom
C103  27.05,24.38 90 top
C104  16.76,28.45 180 top
C105  16.38,32.77 0 top
C106  29.84,31.62 270 bottom
C201  29.21,12.32 180 bottom
C202  29.21,10.29 180 bottom
C203  28.45,10.29 270 top
C204  31.37,15.88 0 top
C205  27.81,17.4 180 top
C206  31.5,17.65 180 bottom
C207  27.94,17.65 0 bottom
C301  7.87,16.76 180 top
C302  7.87,18.29 180 top
C303  7.87,19.81 180 top
C304  8.76,21.08 0 top
C305  20.45,29.21 90 bottom
C306  14.22,25.78 180 top
C307  11.81,20.83 180 top
C308  10.29,23.75 270 top
C309  13.59,10.54 270 top
C310  9.27,23.75 270 top
C401  24.13,12.06 90 top
C402  25.65,12.06 90 top
C403  24.89,12.83 180 bottom
C404  21.84,17.02 270 bottom
C405  21.84,17.02 270 top
C406  24.64,16.76 0 bottom
C407  24.64,15.75 180 top
C408  17.14,15.88 180 top
C409  15.62,16 90 bottom
C410  17.65,15.75 0 bottom
C411  16.38,12.06 180 top
D201  30.1,9.27 90 top
D202  29.59,19.94 180 top
H1  38.99,4.06 0 top
H2  3.81,3.81 0 top
H3  39.37,38.1 0 top
H4  3.81,38.1 0 top
J1  9.53,33.27 0 top
JP101  35.18,30.61 270 top
JP102  34.92,16.13 270 top
JP301  6.86,11.43 270 top
JP302  6.6,24.26 90 top
JP401  20.95,8.13 0 top
L201  28.96,14.99 90 bottom
LED+  17.78,8.38 0 top
LED-  24.13,9.4 0 top
LEDU  9.4,13.97 270 top
LEDV  9.4,11.43 270 top
LEDW  9.4,8.89 270 top
R101  16.64,33.78 0 top
R201  29.21,8.26 180 bottom
R202  28.57,12.32 180 top
R203  30.1,11.81 90 top
R204  31.75,9.53 0 top
R205  29.84,17.4 90 top
R206  31.37,16.89 180 top
R207  31.37,17.91 180 top
R208  28.57,8.26 180 top
R209  32,20.57 0 top
R301  10.29,21.72 90 top
R302  21.34,30.86 180 bottom
R303  7.75,17.27 0 bottom
R304  7.75,19.3 0 bottom
R305  10.16,13.97 0 bottom
R306  10.16,11.43 0 bottom
R307  10.16,8.89 0 bottom
R308  15.88,25.4 90 top
R309  15.88,23.5 90 top
R310  14.86,20.7 90 top
R311  16.89,20.7 90 top
R312  13.34,21.34 270 top
R313  11.81,21.84 0 top
R314  16.76,27.43 180 top
R315  25.65,19.43 90 top
R401  22.86,16.38 90 bottom
R402  22.86,16.38 90 top
R403  24.64,10.67 180 bottom
R404  21.08,10.67 0 bottom
R405  20.32,17.65 0 top
R406  18.41,17.65 180 top
R407  23.88,15.24 90 bottom
R408  24.89,15.24 90 bottom
R409  24.64,16.76 180 top
R410  24.38,14.73 0 top
R411  16.26,8.76 270 top
R412  25.65,8.76 90 top
R413  18.67,15.49 90 top
R414  18.67,13.46 90 top
R415  17.53,13.97 0 bottom
R416  16.76,11.56 0 bottom
R417  17.91,11.56 270 top
R418  16.38,11.05 0 top
R419  15.62,16.38 270 top
TP101  18.54,33.15 0 top
TP102  32.51,29.34 0 top
TP201  32,12.7 270 top
TP202  32,11.05 270 top
TP203  32,14.35 90 top
TP204  27.18,19.43 270 top
TP205  32,19.43 270 top
U100  22.73,28.57 0 top
U101  31.24,31.62 270 top
U200  28.83,14.61 180 top
U300  12.19,17.27 0 top
U301  13.72,23.88 0 top
U302  22.86,20.45 0 bottom
U400  21.59,13.59 0 top
U401  16.64,13.97 0 top
X101  16.38,30.61 270 top

### Tracks (layer width: path | path; a pad name or v marks a point on that pad's centre or on a via)
3.3V  (via drill 0.25)
  Top 0.127: C308.2 C310.2 | 12.7,22.86 U301.VCC+ | v9.53,22.1 10.29,22.1 R301.2 C308.2 | R308.2 15.88,26.42 v16.13,26.67 | C308.2
  Top 0.152: v30.61,18.92 31.5,18.92 TP205.1 32.5,19.93 R209.2
  Top 0.254: R315.1 25.65,18.29 v25.15,17.78 R409.1 | C103.2 26.98,24.95 U100.17 27.82,25.77 v27.94,25.65 | U101.3 30.8,31.3 v30.86,31.24 | 19.05,28.19 19.03,28.18 U100.5 19.16,28.18 19.68,28.7 v19.68,28.83
  Top 0.406: R207.2 R205.2 | v19.68,31.37 U100.1 | C309.1 v13.59,12.32
  Top 0.508: U100.1 18.92,31.36
  Bottom 0.127: v25.15,17.78 24.26,17.78 23.37,16.89 R401.2
  Bottom 0.254: v30.86,31.24 30.74,31.12 C106.2
  Bottom 0.406: v19.68,31.36 v19.68,31.37 | R404.2 20.95,9.89 v20.95,9.4
  Bottom 0.508: C102.2 v19.68,28.83 | C101.2 19.03,31.36 v19.68,31.36
  other vias: 28.7,18.92 29.34,18.92 29.97,18.92 15.49,13.59 15.49,14.35 18.03,16.76 18.8,16.76 19.05,21.08 19.05,20.45 13.46,22.99 12.83,23.5 8.89,22.48 8.89,21.84 5.71,19.05 5.71,19.68 15.49,26.67
  pour Top (no thermals): 27.94,15.75 27.94,16.76 28.19,17.02 28.19,18.29 28.45,18.54 28.45,19.05 28.57,19.18 30.73,19.18 30.86,19.05 30.86,18.54 31.11,18.29 31.11,17.65 29.59,17.65 29.46,17.78 29.46,18.03 29.34,18.16 29.08,18.16 28.96,18.03 28.96,16.76 28.7,16.51 28.7,15.75
  pour Bottom (no thermals): 28.32,18.29 28.45,18.41 28.45,19.05 28.57,19.18 30.73,19.18 30.86,19.05 30.86,18.54 31.11,18.29 31.11,17.02 28.32,17.02
  pour Bottom (no thermals): 15.24,15.75 15.24,13.46 15.37,13.34 15.62,13.34 15.75,13.46 15.75,14.99 16,15.24 16,15.75 15.88,15.88 15.37,15.88
  pour Bottom (no thermals): 18.16,15.24 18.03,15.37 18.03,16.38 17.78,16.64 17.78,16.89 17.91,17.02 18.92,17.02 19.05,16.89 19.05,16.64 18.8,16.38 18.8,15.37 18.67,15.24
  pour Top (no thermals): 18.41,15.75 18.92,15.75 18.92,16.51 19.05,16.64 19.05,16.89 18.92,17.02 17.91,17.02 17.78,16.89 17.78,16.64 17.91,16.51 18.16,16.51 18.41,16.26
  pour Top (no thermals): 15.88,12.57 15.88,14.35 15.62,14.61 15.49,14.61 15.37,14.48 15.37,13.46 15.49,13.34 15.49,12.57
  pour Bottom (no thermals): 20.45,21.21 19.56,21.21 19.43,21.34 18.92,21.34 18.8,21.21 18.8,20.32 18.92,20.19 19.43,20.19 19.56,20.32 20.45,20.32
  pour Route15 (rank 6): 5.08,6.35 5.08,36.83 36.83,36.83 38.1,35.56 38.1,5.08 6.35,5.08
  pour Bottom (no thermals): 7.37,19.94 7.37,18.8 7.24,18.67 5.71,18.67 5.46,18.92 5.46,19.81 5.59,19.94
  pour Top (no thermals): 12.57,22.61 12.57,23.5 12.7,23.62 12.83,23.75 12.95,23.75 13.46,23.24 13.59,23.24 13.72,23.11 13.72,22.99 13.72,22.86 13.59,22.73 13.34,22.73 13.08,22.73 12.95,22.61 12.95,22.48 12.57,22.48
  pour Top: 8.89,23.5 8.89,22.73 8.64,22.48 8.64,21.72 8.76,21.59 9.4,21.59 9.78,21.97 10.54,21.97 10.54,23.5
BOOT
  Top 0.254: U100.31 20.73,33.5 20.45,33.78 19.05,33.78 | 19.05,33.78 R101.2 | 19.05,33.78 18.54,33.27 TP101.1
CAN_H
  Top 0.254: U101.7 35.11,31.95 JP101.2
CAN_L
  Top 0.254: U101.6 33.22,31.3 JP101.3
CAN_RX
  Top 0.254: U100.21 27.7,28.98 29.38,30.65 U101.4
CAN_SHDN
  Top 0.254: U101.5 32.54,29.37 TP102.1
CAN_TX
  Top 0.254: U100.22 27.74,29.77 28.32,30.35 28.32,31.75 29.17,32.6 U101.1
CRYSTALIN
  Top 0.254: C105.1 15.88,31.56 X101.1 arc90 16.61,30.57 U100.2
CRYSTALOUT
  Top 0.254: C104.1 arc90 17.01,28.57 X101.3 arc90 X101.3 U100.3
GND  (via drill 0.25)
  Top 0.127: X101.4 16.89,31.5 C105.2 | 16.26,12.7 v16.26,12.83 | 16.64,15.11 U401.VCC- 16.64,15.11
  Top 0.254: U200.4 29.32,15.36 v29.21,15.24 28.98,15.01 28.98,14.61 U200.10 28.7,14.61 | U400.7 21.84,13.34 21.65,13.53 | 21.65,13.53 U400.EPAD 21.34,13.84 U400.15 | 21.65,13.53 21.27,13.53 20.83,13.97 20.84,13.98 U400.16 20.84,15.51 v21.08,15.75 | U101.2 30.68,31.95 v30.86,32.13 | C405.1 v21.09,16.76 v21.08,16.76 | U300.7 12.44,17.02 U300.EPAD | C306.2 C306.2 arc-90 v14.61,26.67 | C105.2
  Top 0.406: C105.2 16.88,31.56 X101.4 17.71,32.13 v17.91,32.13
  Bottom 0.127: 25.02,16.64 25.02,15.88 R408.2 | 25.02,16.64 25.02,16.76 C406.1 25.02,16.64 | 25.02,16.64 26.16,16.64 26.92,17.4 26.92,17.65 C207.2
  Bottom 0.254: v30.86,32.13 C106.1 | C405.1 v21.09,16.76 v21.08,16.76
  other vias: 32.64,16.38 31.11,11.68 30.99,11.05 31.11,10.41 32.64,15.11 32.64,15.75 29.34,11.3 31.11,14.99 32.77,18.8 29.59,19.94 17.27,16.76 16.51,16.76 16.89,12.83 20.7,16.26 20.32,15.75 20.32,16.76 24.64,13.97 19.05,32.13 26.29,14.61 26.04,15.24 25.65,14.61 25.4,13.97 26.04,13.97 12.45,14.73 20.32,27.94 13.59,8.64 20.95,23.37 17.65,10.16 15.24,18.8 15.88,18.8 16.51,18.8 24.26,19.94 13.46,14.86 9.27,28.32 10.79,25.78 13.08,28.45 5.97,27.05 14.1,31.37 17.27,36.32 21.21,36.2 26.8,32.51 28.32,36.07 30.86,34.54 28.32,33.66 32.13,36.32 33.02,33.4 37.59,27.94 31.88,26.67 30.48,27.81 29.59,29.34 29.08,28.07 24.77,30.61 24.77,27.69 24.77,25.91 18.41,22.23 28.7,21.72 31.24,21.72 32,24.13 14.61,6.35 10.41,6.22 12.57,7.24 24.13,6.1 29.46,6.48 33.4,7.87 12.19,10.03 14.22,23.5 17.14,23.88 9.91,20.19 13.84,18.8 14.99,32.77 15.24,28.7 14.61,29.84 22.48,34.16 13.46,33.66 6.1,33.53 5.97,30.1 12.95,35.31 29.21,23.37 28.19,24.77 28.19,26.67 28.83,31.5 26.04,17.78 26.04,17.14 23.24,9.53 18.67,9.65 5.84,21.08
  pour Top (no thermals): 21.46,14.73 21.46,15.37 21.34,15.49 21.34,16.89 21.21,17.02 20.32,17.02 20.19,16.89 20.19,14.86 20.45,14.61 21.34,14.61
  pour Top (rank 6): 5.08,6.35 5.08,36.83 36.83,36.83 38.1,35.56 38.1,5.08 6.35,5.08
  pour Bottom (rank 6): 5.08,36.83 5.08,6.35 6.35,5.08 38.1,5.08 38.1,35.56 36.83,36.83
  pour Route2: 5.08,36.83 5.08,6.35 6.35,5.08 38.1,5.08 38.1,35.56 36.83,36.83
  pour Top (no thermals): 13.46,25.53 13.97,25.53 13.97,26.04 14.22,26.29 14.73,26.29 14.99,26.54 14.99,26.92 14.86,27.05 14.48,27.05 13.46,26.04
N$1  (via drill 0.25)
  Top 0.254: R315.2 25.14,20.45 v24.77,20.45
  Bottom 0.254: v24.77,20.45 U302.4
N$2
  Bottom 0.254: R407.2 24,15.87 24,16.63 C406.2
N$3
  Top 0.254: U400.2 20.23,13.81 19.91,13.81 19.44,14.28 19.44,17.05 19.27,17.23 19.27,17.3 R406.1
N$4  (via drill 0.25)
  Route15 0.254: v24.26,18.41 19.33,23.34 18.85,23.34 18.01,22.5 13.26,22.5 12.8,22.96 8.89,22.96 8.69,22.96 6.63,22.96 JP302.1
  Bottom 0.254: U302.7 24.34,18.5 v24.26,18.41
N$5
  Top 0.254: U400.1 19.82,14.72 R405.1
N$6  (via drill 0.25)
  Top 0.254: v8.13,14.86 8.14,14.48 LEDU.A
  Bottom 0.254: R305.1 10.8,13.97 9.82,14.95 8.7,14.95 8.61,14.86 v8.13,14.86
N$10  (via drill 0.25)
  Top 0.254: v8.13,12.19 8.13,11.95 LEDV.A
  Bottom 0.254: v8.13,12.19 8.48,12.19 8.7,12.41 10.08,12.41 R306.1
N$11  (via drill 0.25)
  Top 0.254: v8.13,9.65 8.13,9.41 LEDW.A
  Bottom 0.254: v8.13,9.65 8.48,9.65 8.7,9.87 10.08,9.87 R307.1
N$12  (via drill 0.25)
  Top 0.254: v11.94,15.11 U300.6
  Top 0.406: C303.1 9.31,19.18 v9.65,19.18 | C302.1 v9.65,18.29 | C301.1 9.31,17.4 v9.65,17.4
  Bottom 0.254: v9.65,17.4 9.78,17.27 9.78,15.62 10.29,15.11 v11.94,15.11
  Bottom 0.406: R303.1 8.77,17.4 v9.65,17.4 v9.65,18.29 v9.65,19.18 8.77,19.18 R304.1
N$13  (via drill 0.25)
  Route15 0.254: v24.64,19.05 24.23,19.46 24.06,19.46 18.04,25.48 17.02,25.48 16.84,25.3 6.83,25.3 JP302.2
  Bottom 0.254: U302.6 24.73,19.15 v24.64,19.05
N$14
  Top 0.254: R312.1 13.33,21.84 R313.2 | R313.2 C307.1 | R312.1 13.4,21.9 12.7,21.84 R313.2 | U301.IN- 14.28,22.78 R312.1
N$15
  Top 0.305: C408.1 17.59,15.88 U401.IN+ 17.59,14.99 R413.1 R414.2
N$16
  Top 0.254: C306.1 14.72,25.03 U301.IN+ 15.8,24.98 R308.1 R309.2
N$17
  Top 0.254: R418.2 C411.1 17.27,12.06 | 17.27,12.06 R417.1 | 17.27,12.06 17.59,12.37 U401.IN-
N$19  (via drill 0.25)
  Top 0.254: v22.99,14.86 U400.12
  Bottom 0.254: R408.1 R407.1 23.76,14.86 v22.99,14.86
N$20  (via drill 0.25)
  Top 0.254: C402.1 C401.1 24.77,11.9 v24.77,12.06 | U400.6 21.34,11.79 v21.08,11.53
  Bottom 0.254: v24.77,12.06 24.77,12.57 24.51,12.83 C403.1 24.09,11.02 R403.1 R404.1 21.34,10.67 21.08,10.92 v21.08,11.53
N$22
  Top 0.254: LED+.A 17.23,8.18 17.23,8.43 16.26,9.4 R411.1
N$23
  Top 0.254: LED-.A 24.64,8.65 R412.2
N$25
  Top 0.254: U400.11 23.3,13.84 23.55,14.08 23.55,14.4 R410.1 arc90 24,14.85 24,15.61 arc-90 C407.2 R409.2
N$27
  Top 0.254: R418.1 C411.2 15.63,12.32 15.38,12.32 15.01,12.69 15.01,14.55 15.53,15.07 U401.OUT 15.69,15.82 R419.2
N$29
  Top 0.254: C307.2 R313.1 11.31,23.52 U301.OUT 13.17,25.38 13.17,26.21 14.4,27.43 R314.2
N$270
  Top 0.152: R208.1 29.96,8.26 D201.A
  Top 0.61: D201.A arc-90 30.21,8.51
N$271
  Top 0.152: R209.1 31.1,20.57 D202.A
NRESET  (via drill 0.25)
  Top 0.254: v19.68,34.27 17.76,34.27 17.64,34.39 15.51,34.39 11.86,30.73 J1.!RESET | U100.4 19.03,28.98 19.05,28.96 19.68,29.59 v19.68,30.1
  Bottom 0.127: 20.32,33.78 20.22,33.73
  Bottom 0.254: v19.68,30.1 19.68,30.62 20.22,31.15 20.22,33.73 v19.68,34.27
OUT1  (via drill 0.25)
  Top 0.254: U400.10 23.49,13.34 23.62,13.47 v23.93,13.79 | U400.3 v19.43,13.34 v19.43,11.81 | v22.86,11.68 22.86,10.79 23.51,10.15 LED-.C | R411.2 16.39,7.86 17.27,6.98 18.54,6.98 JP401.1
  Bottom 0.254: v23.93,13.79 22.98,12.83 | v19.43,13.34 19.94,12.83 22.98,12.83 | v19.43,11.81 19.43,11.46 19.35,11.38 19.35,9.96 19.68,9.62 JP401.1 | 22.98,12.83 23,12.8 23.06,12.8 23.34,12.52 23.34,12.12 23.06,11.84 23.01,11.84 v22.86,11.68
OUT2
  Top 0.127: 17.78,9.14 LED+.C
  Top 0.254: 20.6,11.33 20.6,11.73 20.84,11.97 U400.5 | 20.6,11.33 20.88,11.05 21.28,11.05 21.29,11.05 21.97,11.05 | 21.97,11.05 22.34,11.42 U400.8 | 21.97,11.05 21.97,8.38 JP401.2 22.49,7.86 R412.1 | LED+.C 17.78,9.65 17.8,9.68 17.85,9.68 18.61,10.44 18.87,10.44 19.76,11.33 20.6,11.33
PA0/CURR_FDB_BLDC
  Top 0.254: R314.1 18.43,27.43 U100.6
PA1/CURR_FDB_MAG  (via drill 0.25)
  Top 0.254: v19.05,22.86 18.48,23.43 18.48,24.57 17.63,25.42 17.63,26.13 17.78,26.28 18.19,26.28 U100.7 | v16.89,17.27 16.87,17.25 16.31,17.25 15.95,16.88 R419.1
  Bottom 0.254: v16.89,17.27 17.89,18.27 18.02,18.27 18.3,18.56 18.3,21.02 19.05,21.77 v19.05,22.86
PA2/USART2_TX  (via drill 0.25)
  Top 0.254: U100.8 19.3,24.95 19.3,23.5 21.08,21.72 25.27,21.72 25.53,21.97 v27.43,21.97
  Bottom 0.254: JP102.P$2 33.17,19.94 32.29,20.83 28.83,20.83 28.32,20.83 27.84,20.83 27.43,21.24 v27.43,21.97
PA3/USART2_RX  (via drill 0.25)
  Top 0.254: U100.9 19.94,23.62 21.31,22.25 25.09,22.25 25.32,22.48 v26.67,22.48
  Bottom 0.254: 26.64,22.5 26.65,22.5 v26.67,22.48 26.67,21.46 27.69,20.45 32.13,20.45 33.27,19.3 33.27,18.29 34.16,17.4 JP102.P$3
PA4/FAULT_BLDC  (via drill 0.25)
  Top 0.254: v19.81,25.53 19.81,25.4 20.03,25.18 20.29,25.18 20.44,25.03 20.44,24.62 U100.10 20.73,25.43 v20.83,25.53 | U300.13 v12.94,19.42 v12.95,19.43
  Bottom 0.254: v19.81,25.53 13.72,19.43 v12.95,19.43 | v20.83,25.53 20.83,27.48 21.05,27.7 21.05,29.11 C305.2 20.45,30.47 R302.1
PA5/SPI1_SCK  (via drill 0.25)
  Top 0.254: v24.77,22.73 22.35,22.73 21.53,23.55 U100.11
  Bottom 0.254: U302.2 25.12,21.75 24.77,22.1 v24.77,22.73
PA6/CAN_LSTN
  Top 0.254: U100.12 22.35,24.31 22.35,23.62 22.73,23.24 27.39,23.24 31.62,27.48 31.62,32.26 31.96,32.6 U101.8
PA7/INUL  (via drill 0.25)
  Top 0.254: U100.13 23.13,25.38 22.48,26.04 19.94,26.04 v19.81,26.16 | v10.79,19.18 U300.1
  Bottom 0.254: v19.81,26.16 17.78,26.16 v10.79,19.18
PA8/INUH/PWM_MAG  (via drill 0.25)
  Top 0.127: v10.29,18.54 10.29,17.78 10.54,17.53 U300.2 | v14.86,15.49 14.86,17.02 15.62,17.78 17.91,17.78 R406.2
  Top 0.254: R406.2 17.94,17.65 18.54,18.26 20.67,18.26 21.46,19.05 v21.46,20.32 | v21.46,29.46 24.99,29.46 25.65,28.8 25.65,27.05 26.13,26.57 U100.18
  Bottom 0.127: v10.29,18.54 10.29,15.88 10.67,15.49 11.68,15.49 11.81,15.62 13.34,15.62 13.46,15.49 v14.86,15.49
  Bottom 0.254: v21.46,20.32 v21.46,29.46
PA9/INVH/DIR_MAG  (via drill 0.25)
  Top 0.127: v18.8,19.81 18.54,20.07 18.54,21.46 16.51,23.5 15.37,23.5 14.86,24 12.7,24 11.81,23.11 11.81,20.32 11.43,19.94 U300.16
  Top 0.254: v22.1,29.97 25.02,29.97 26.04,28.96 26.04,27.69 26.35,27.38 U100.19 | v22.1,19.43 22.1,18.93 R405.2
  Bottom 0.127: v18.8,19.81 18.8,18.67 19.43,18.03 21.72,18.03
  Bottom 0.152: 21.72,18.03 arc90 22.1,18.41 v22.1,19.43
  Bottom 0.254: v22.1,19.43 v22.1,29.97
PA10/INWH  (via drill 0.25)
  Top 0.254: U100.20 27.67,28.18 29.55,26.29 v29.59,26.29 | U300.12 15.31,18.02 15.54,18.26 18,18.26 20.67,20.93 28.68,20.93 30.48,22.73 v30.48,25.4
  Bottom 0.254: v29.59,26.29 v30.48,25.4
PA15/SPI1_NSS  (via drill 0.25)
  Top 0.254: v25.53,31.75 U100.25
  Bottom 0.254: 25.61,31.67 v25.53,31.75 25.53,22.61 U302.1
PB0/INVL  (via drill 0.25)
  Top 0.254: U100.14 23.89,24.37 23.89,25.16 22.31,26.75 v19.81,26.75 | v16.76,25.91 17.14,25.53 17.14,25.36 17.27,25.24 17.27,25.02 v17.3,25 | v11.94,19.56 U300.15
  Bottom 0.254: v19.81,26.75 17.6,26.75 v16.76,25.91 | v17.3,25 11.94,19.64 v11.94,19.56
PB1/INWL  (via drill 0.25)
  Top 0.254: U100.15 24.69,24.37 24.69,24.9 22.16,27.43 v19.81,27.43 | v14.44,17.54 14.43,17.52 U300.11
  Bottom 0.254: v14.44,17.54 14.76,17.85 14.76,19.5 20.3,25.04 20.3,26.95 v19.81,27.43
PB3/EN_MAG  (via drill 0.25)
  Top 0.254: R402.2 v22.86,18.41 | v22.86,30.48 23.39,31.01 24.2,31.01 24.73,31.54 U100.26
  Bottom 0.254: v22.86,18.41 v22.86,30.48
PB4/SPI1_MISO  (via drill 0.25)
  Top 0.254: v24,31.5 23.93,31.57 U100.27
  Bottom 0.254: U302.3 25.03,21.1 25.02,21.08 24,22.1 v24,31.5
PB6/EN_BLDC  (via drill 0.25)
  Top 0.254: v22.61,31.11 22.33,31.39 U100.29
  Bottom 0.254: R302.2 22.35,30.86 v22.61,31.11
PB7/FAULT_MAG  (via drill 0.25)
  Top 0.254: R402.1 22.86,15.5 U400.13 | R402.1 22.23,16.52 C405.2 | R402.1 22.86,15.9 23.46,16.51 v23.46,17.77 | v21.59,31.62 21.53,31.68 U100.30
  Bottom 0.254: v23.46,17.77 23.46,31.02 22.86,31.62 v21.59,31.62
SENSE_BLDC  (via drill 0.25)
  Top 0.254: U300.9 v13.58,16.01 v13.59,16 | v10.79,16 10.8,16.01 U300.4 | R310.2 15.24,21.6 | 15.24,21.6 15.88,21.6 | 16.51,21.6 R311.2 16.89,21.34 17.87,20.36 17.87,19.24 17.82,19.19 v17.82,18.76 | 15.24,21.6 15.88,22.24 | 15.88,22.24 16.51,21.6 | 16.51,21.6 15.88,21.6 | 15.88,21.6 R309.1 15.88,22.24 | 15.88,22.24 arc-90 15.24,21.6 | 15.88,22.24 arc90 16.51,21.6
  Bottom 0.254: v10.79,16 v13.59,16 15.14,17.55 15.14,17.85 15.42,18.14 17.2,18.14 v17.82,18.76
SENSE_MAG  (via drill 0.25)
  Top 0.254: U400.4 v20.2,12.33 v20.19,12.32 | U400.9 22.98,12.33 v22.86,12.32
  Bottom 0.254: v22.86,12.32 v20.19,12.32 18.8,12.32 v18.67,12.19
  other vias: 18.67,10.92 18.67,11.56
  pour Top (no thermals): 18.41,13.21 18.92,13.21 18.92,10.79 18.8,10.67 18.54,10.67 18.41,10.79
  pour Bottom (no thermals): 18.8,10.67 18.54,10.67 18.41,10.79 17.27,10.79 17.14,10.92 17.14,12.19 17.27,12.32 18.16,12.32 18.41,12.57 18.41,12.95 18.16,13.21 18.03,13.21 17.91,13.34 17.91,14.61 18.03,14.73 18.92,14.73 19.05,14.61 19.05,13.34 18.92,13.21 18.92,10.79
STBY/RESET_BLDC  (via drill 0.25)
  Top 0.127: v13.08,20.07 12.95,20.07 12.45,19.56 U300.14 | v10.92,20.07 10.92,20.32 10.29,20.95 10.29,21.08 | 10.29,21.08 R301.1 10.29,21.21 | 10.29,21.08 C304.2
  Route15 0.152: v10.92,20.07 v13.08,20.07
STBY/RESET_MAG  (via drill 0.25)
  Top 0.254: v21.84,15.75 v21.84,15.74 U400.14
  Bottom 0.254: R401.1 22.23,16.52 C404.2 v21.84,15.75
SWCLK
  Top 0.254: U100.24 26.04,32.32 26.04,33.53 24.8,34.77 15.24,34.77 15.03,34.77 10.38,34.77 J1.SWDCLK
SWDIO
  Top 0.254: U100.23 27.28,30.87 27.69,30.87 27.84,31.02 27.84,32.27 24.96,35.15 15.24,35.15 14.57,35.81 J1.SWDIO
TPS-EN
  Top 0.254: R202.1 29.05,12.55 U200.14 29.05,13.47 29.43,13.86 U200.1 29.99,13.84 31.11,13.84 32,12.95 TP201.1
  Top 0.508: R202.1 R203.2
TPS-FB
  Top 0.254: U200.5 29.55,16.61 R205.1
  Top 0.406: R205.1 R206.2
TPS-FB2
  Top 0.152: U200.6 29.05,15.72 28.83,15.49 28.82,15.5 27.86,15.5 27.73,15.64 27.73,18.88 TP204.1
TPS-L1  (via drill 0.25)
  other vias: 26.8,13.97 26.8,13.34 26.8,12.7
  pour Bottom (no thermals): 26.67,14.22 30.61,14.22 30.61,13.34 27.3,13.34 27.18,13.21 27.18,12.7 26.92,12.45 26.67,12.45 26.54,12.57 26.54,14.1
  pour Top (no thermals): 28.7,14.22 26.67,14.22 26.54,14.1 26.54,12.57 26.67,12.45 26.92,12.45 27.18,12.7 27.18,13.59 27.43,13.84 28.7,13.84
TPS-L2  (via drill 0.25)
  other vias: 26.8,15.24 26.8,15.88 26.8,16.51
  pour Top (no thermals): 28.7,14.99 26.67,14.99 26.54,15.11 26.54,16.64 26.67,16.76 26.92,16.76 27.18,16.51 27.18,15.62 27.56,15.24 28.7,15.24
  pour Bottom (no thermals): 27.05,16.76 27.18,16.64 30.61,16.64 30.61,15.62 27.56,15.62 26.92,14.99 26.67,14.99 26.54,15.11 26.54,16.64 26.67,16.76
TPS-PG
  Top 0.254: R207.1 31.89,17.91 33.22,16.57 33.22,14.93 32.64,14.35 TP203.1 31.62,14.36 U200.2
TPS-VAUX
  Top 0.254: U200.3 30.25,14.86 30.87,15.47 C204.1
TPS-VIN  (via drill 0.25)
  other vias: 27.18,11.81 27.18,10.67 27.18,9.4
  pour Top (no thermals): 28.7,13.46 28.7,12.95 28.32,12.57 28.32,11.94 28.83,11.43 28.83,10.79 28.7,10.67 28.07,10.67 27.94,10.79 27.94,11.3 27.81,11.43 27.69,11.43 27.56,11.3 27.56,9.4 27.3,9.14 27.05,9.14 26.92,9.27 26.92,12.06 27.05,12.19 27.18,12.19 27.94,12.95 27.94,13.46
  pour Bottom (no thermals): 26.92,12.06 27.05,12.19 27.18,12.19 27.69,12.7 27.69,12.83 27.81,12.95 28.83,12.95 28.96,12.83 28.96,7.75 28.7,7.49 27.81,7.49 27.69,7.62 27.69,8.76 27.3,9.14 27.05,9.14 26.92,9.27
TPS-VSEL
  Top 0.254: U200.15 29.68,13.34 30.86,13.34 31.11,13.08 31.11,12.42 32,11.53 TP202.1 32,9.77 R204.2
U
  Top 0.254: U300.3 10.29,17.02 8.61,15.34 7.93,15.34 7.64,15.06 7.64,14.76 JP301.1
  Bottom 0.508: R305.2 JP301.1
V
  Top 0.254: U300.8 12.97,15.91 12.97,14.32 11.33,12.68 7.93,12.68 7.64,12.39 7.64,12.22 JP301.2
  Bottom 0.508: R306.2 JP301.2
V_BATT  (via drill 0.25)
  Top 0.254: R208.2 v27.3,8.26
  Bottom 0.508: R403.2 25.54,10.02 v27.3,8.26
  other vias: 32,8.76 31.62,8.26 32,7.75 31.24,7.75 31.24,8.76 5.71,17.02 5.71,17.65
  pour Bottom (no thermals): 29.59,8.89 29.72,9.02 32.13,9.02 32.26,8.89 32.26,7.62 32.13,7.49 29.72,7.49 29.59,7.62
  pour Bottom (no thermals): 7.37,17.91 5.59,17.91 5.46,17.78 5.46,16.89 5.71,16.64 7.37,16.64
  pour Route15 (no thermals): 34.54,33.15 33.91,33.78 33.91,35.05 34.54,35.69 35.94,35.69 36.07,35.56 38.1,35.56 38.1,4.95 6.35,4.95 5.08,6.22 5.08,18.29 6.22,18.29 6.35,18.16 6.35,15.11 5.71,14.48 5.71,8.26 7.87,6.1 24.38,6.1 26.92,8.64 30.23,8.64 30.86,9.27 32.77,9.27 33.78,8.26 36.2,8.26 36.83,8.89 36.83,32.38 36.07,33.15
W
  Top 0.254: U300.10 13.68,16.93 14,16.93 14.15,16.78 14.15,16.27 14.1,16.21 14.1,14.22 10.65,10.78 8.57,10.78 7.64,9.85 7.64,9.68 JP301.3
  Bottom 0.508: R307.2 JP301.3